# EAGLE design calc1 (EAGLE 5.11)
TITLE: Calcumaker

## Sheet 1 of 4
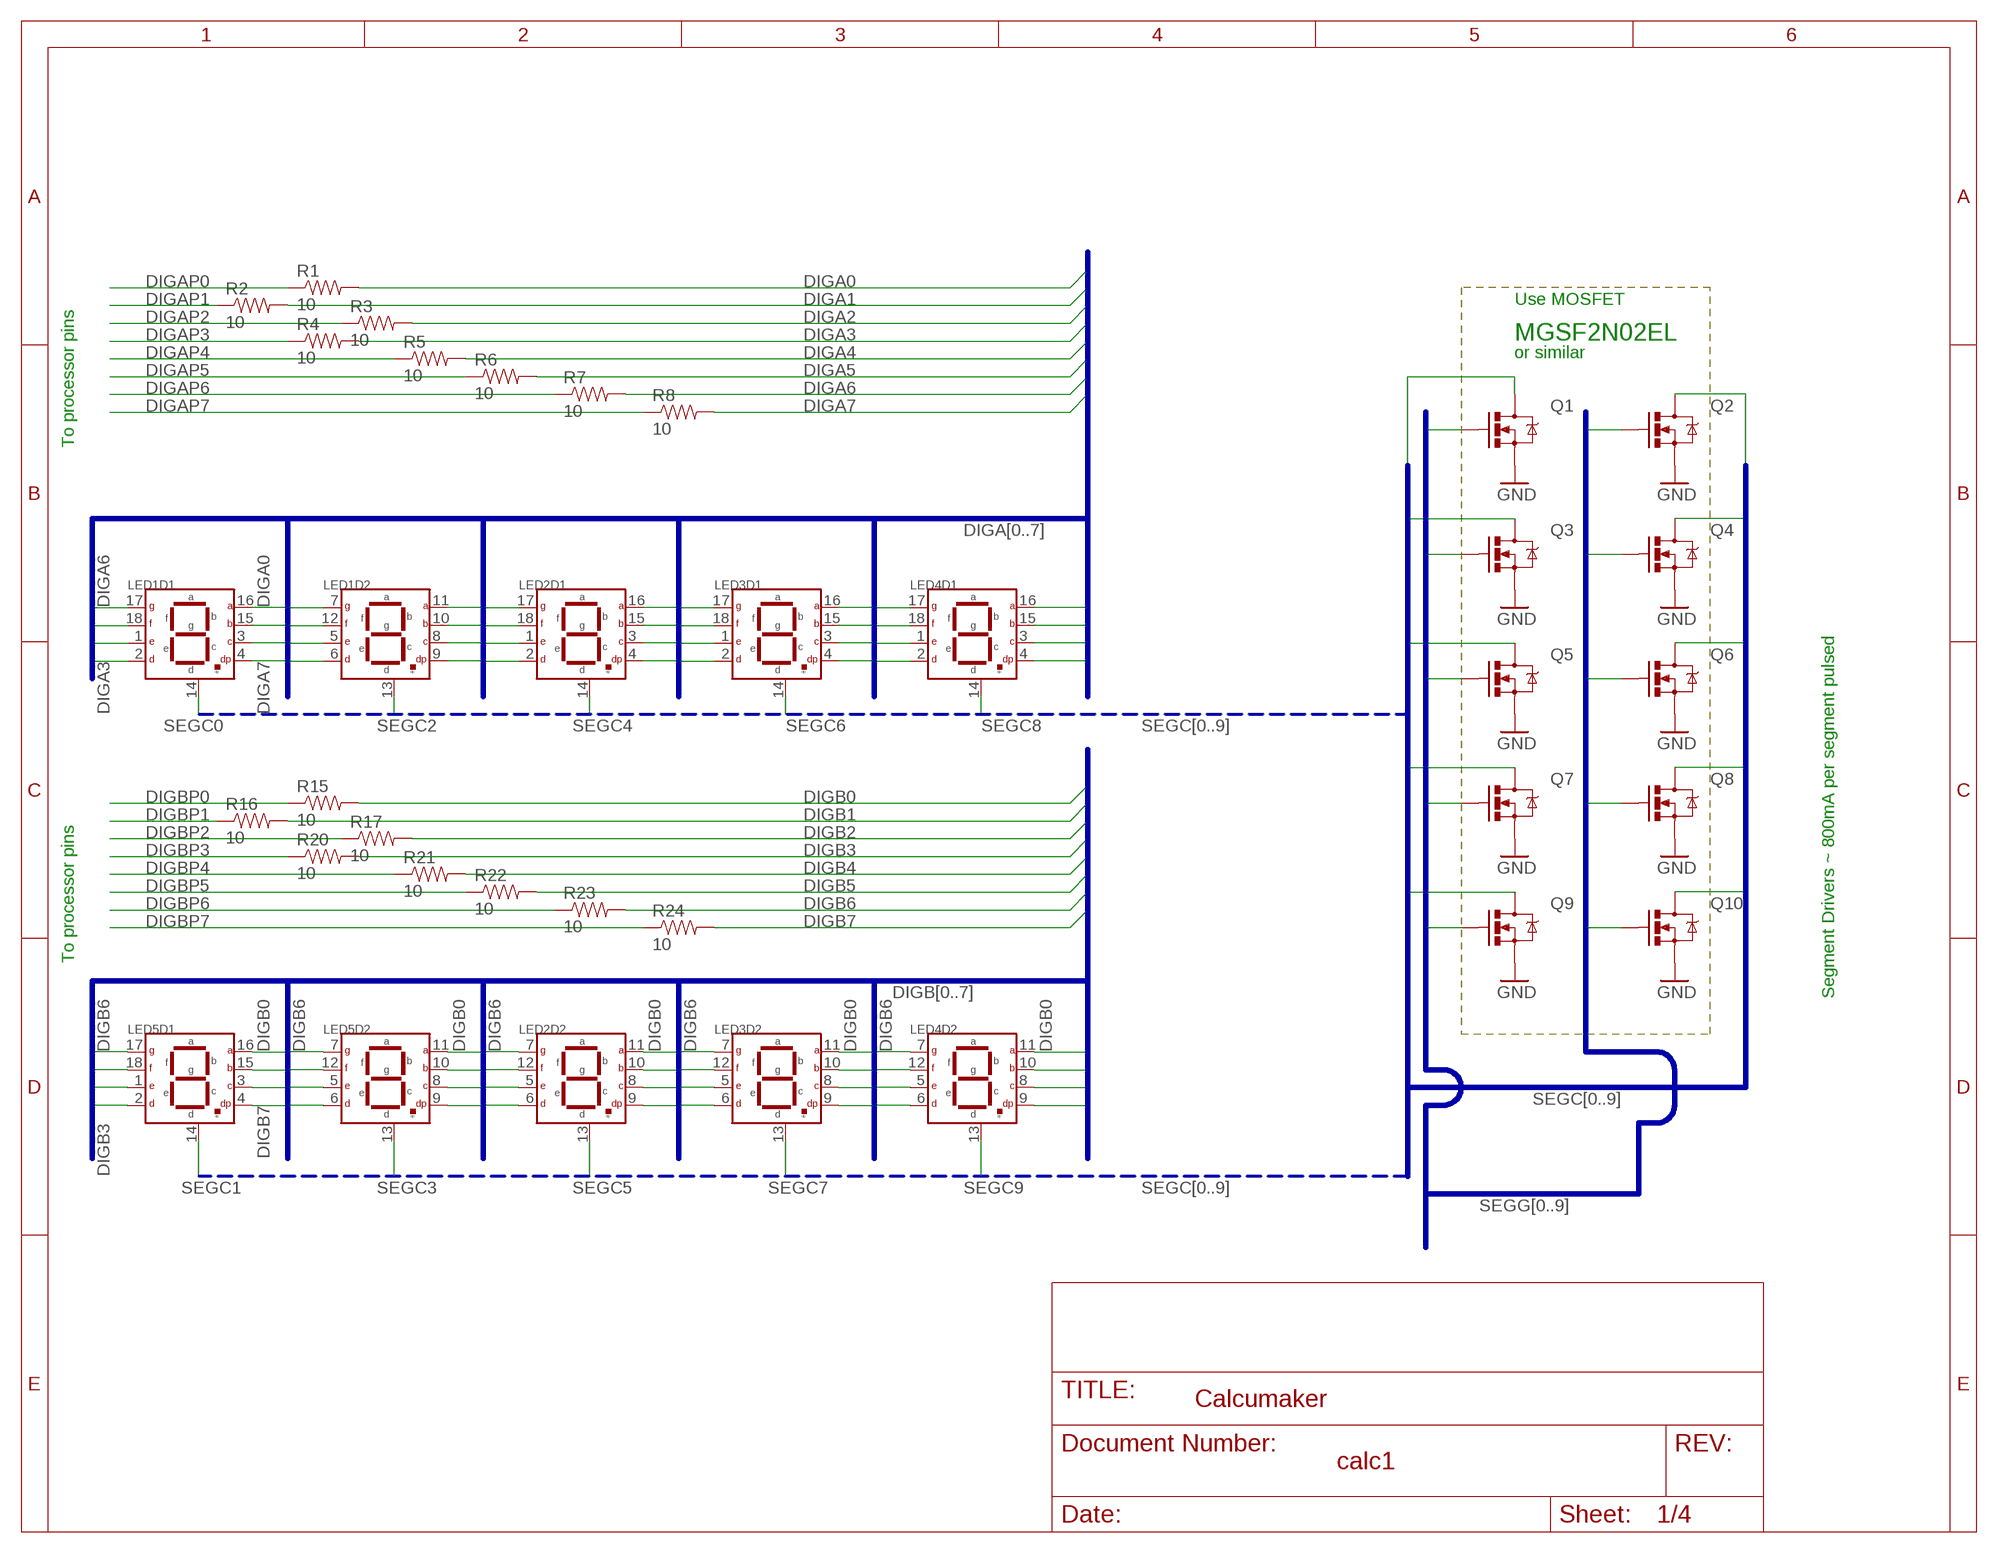
[diagram p0: schematic, sheet 1]

### Parts
LED1  2X7SEGMENT2X  [2X7SEG_PTH]
LED2  2X7SEGMENT2X  [2X7SEG_PTH]
LED3  2X7SEGMENT2X  [2X7SEG_PTH]
LED4  2X7SEGMENT2X  [2X7SEG_PTH]
LED5  2X7SEGMENT2X  [2X7SEG_PTH]
Q1  MOSFET-NCHANNELSMD  [SOT23-3]
Q2  MOSFET-NCHANNELSMD  [SOT23-3]
Q3  MOSFET-NCHANNELSMD  [SOT23-3]
Q4  MOSFET-NCHANNELSMD  [SOT23-3]
Q5  MOSFET-NCHANNELSMD  [SOT23-3]
Q6  MOSFET-NCHANNELSMD  [SOT23-3]
Q7  MOSFET-NCHANNELSMD  [SOT23-3]
Q8  MOSFET-NCHANNELSMD  [SOT23-3]
Q9  MOSFET-NCHANNELSMD  [SOT23-3]
Q10  MOSFET-NCHANNELSMD  [SOT23-3]
R1  10  RESISTOR  [0805]
R2  10  RESISTOR  [0805]
R3  10  RESISTOR  [0805]
R4  10  RESISTOR  [0805]
R5  10  RESISTOR  [0805]
R6  10  RESISTOR  [0805]
R7  10  RESISTOR  [0805]
R8  10  RESISTOR  [0805]
R15  10  RESISTOR  [0805]
R16  10  RESISTOR  [0805]
R17  10  RESISTOR  [0805]
R20  10  RESISTOR  [0805]
R21  10  RESISTOR  [0805]
R22  10  RESISTOR  [0805]
R23  10  RESISTOR  [0805]
R24  10  RESISTOR  [0805]

### Nets
DIGA0: LED1.11(D2:A) LED1.16(D1:A) LED2.16(D1:A) LED3.16(D1:A) LED4.16(D1:A) R1.2
DIGA1: LED1.10(D2:B) LED1.15(D1:B) LED2.15(D1:B) LED3.15(D1:B) LED4.15(D1:B) R2.2
DIGA2: LED1.3(D1:C) LED1.8(D2:C) LED2.3(D1:C) LED3.3(D1:C) LED4.3(D1:C) R3.2
DIGA3: LED1.2(D1:D) LED1.6(D2:D) LED2.2(D1:D) LED3.2(D1:D) LED4.2(D1:D) R4.2
DIGA4: LED1.1(D1:E) LED1.5(D2:E) LED2.1(D1:E) LED3.1(D1:E) LED4.1(D1:E) R5.2
DIGA5: LED1.12(D2:F) LED1.18(D1:F) LED2.18(D1:F) LED3.18(D1:F) LED4.18(D1:F) R6.2
DIGA6: LED1.7(D2:G) LED1.17(D1:G) LED2.17(D1:G) LED3.17(D1:G) LED4.17(D1:G) R7.2
DIGA7: LED1.4(D1:DP) LED1.9(D2:DP) LED2.4(D1:DP) LED3.4(D1:DP) LED4.4(D1:DP) R8.2
DIGAP0: R1.1 ; also sheet 2
DIGAP1: R2.1 ; also sheet 2
DIGAP2: R3.1 ; also sheet 2
DIGAP3: R4.1 ; also sheet 2
DIGAP4: R5.1 ; also sheet 2
DIGAP5: R6.1 ; also sheet 2
DIGAP6: R7.1 ; also sheet 2
DIGAP7: R8.1 ; also sheet 2
DIGB0: LED2.11(D2:A) LED3.11(D2:A) LED4.11(D2:A) LED5.11(D2:A) LED5.16(D1:A) R15.2
DIGB1: LED2.10(D2:B) LED3.10(D2:B) LED4.10(D2:B) LED5.10(D2:B) LED5.15(D1:B) R16.2
DIGB2: LED2.8(D2:C) LED3.8(D2:C) LED4.8(D2:C) LED5.3(D1:C) LED5.8(D2:C) R17.2
DIGB3: LED2.6(D2:D) LED3.6(D2:D) LED4.6(D2:D) LED5.2(D1:D) LED5.6(D2:D) R20.2
DIGB4: LED2.5(D2:E) LED3.5(D2:E) LED4.5(D2:E) LED5.1(D1:E) LED5.5(D2:E) R21.2
DIGB5: LED2.12(D2:F) LED3.12(D2:F) LED4.12(D2:F) LED5.12(D2:F) LED5.18(D1:F) R22.2
DIGB6: LED2.7(D2:G) LED3.7(D2:G) LED4.7(D2:G) LED5.7(D2:G) LED5.17(D1:G) R23.2
DIGB7: LED2.9(D2:DP) LED3.9(D2:DP) LED4.9(D2:DP) LED5.4(D1:DP) LED5.9(D2:DP) R24.2
DIGBP0: R15.1 ; also sheet 2
DIGBP1: R16.1 ; also sheet 2
DIGBP2: R17.1 ; also sheet 2
DIGBP3: R20.1 ; also sheet 2
DIGBP4: R21.1 ; also sheet 2
DIGBP5: R22.1 ; also sheet 2
DIGBP6: R23.1 ; also sheet 2
DIGBP7: R24.1 ; also sheet 2
GND: Q1.2(S) Q2.2(S) Q3.2(S) Q4.2(S) Q5.2(S) Q6.2(S) Q7.2(S) Q8.2(S) Q9.2(S) Q10.2(S) ; also sheet 2,3
SEGC0: LED1.14(D1:CC) Q1.3(D)
SEGC1: LED5.14(D1:CC) Q3.3(D)
SEGC2: LED1.13(D2:CC) Q5.3(D)
SEGC3: LED5.13(D2:CC) Q7.3(D)
SEGC4: LED2.14(D1:CC) Q9.3(D)
SEGC5: LED2.13(D2:CC) Q2.3(D)
SEGC6: LED3.14(D1:CC) Q4.3(D)
SEGC7: LED3.13(D2:CC) Q6.3(D)
SEGC8: LED4.14(D1:CC) Q8.3(D)
SEGC9: LED4.13(D2:CC) Q10.3(D)
SEGG0: Q1.1(G) ; also sheet 2
SEGG1: Q3.1(G) ; also sheet 2
SEGG2: Q5.1(G) ; also sheet 2
SEGG3: Q7.1(G) ; also sheet 2
SEGG4: Q9.1(G) ; also sheet 2
SEGG5: Q2.1(G) ; also sheet 2
SEGG6: Q4.1(G) ; also sheet 2
SEGG7: Q6.1(G) ; also sheet 2
SEGG8: Q8.1(G) ; also sheet 2
SEGG9: Q10.1(G) ; also sheet 2

### Buses
DIGA[0..7]
SEGC[0..9]
SEGG[0..9]
DIGB[0..7]

### Notes on the sheet
- Use MOSFET
- MGSF2N02EL
- or similar
- To processor pins
- To processor pins
- Segment Drivers ~ 800mA per segment pulsed

## Sheet 2 of 4
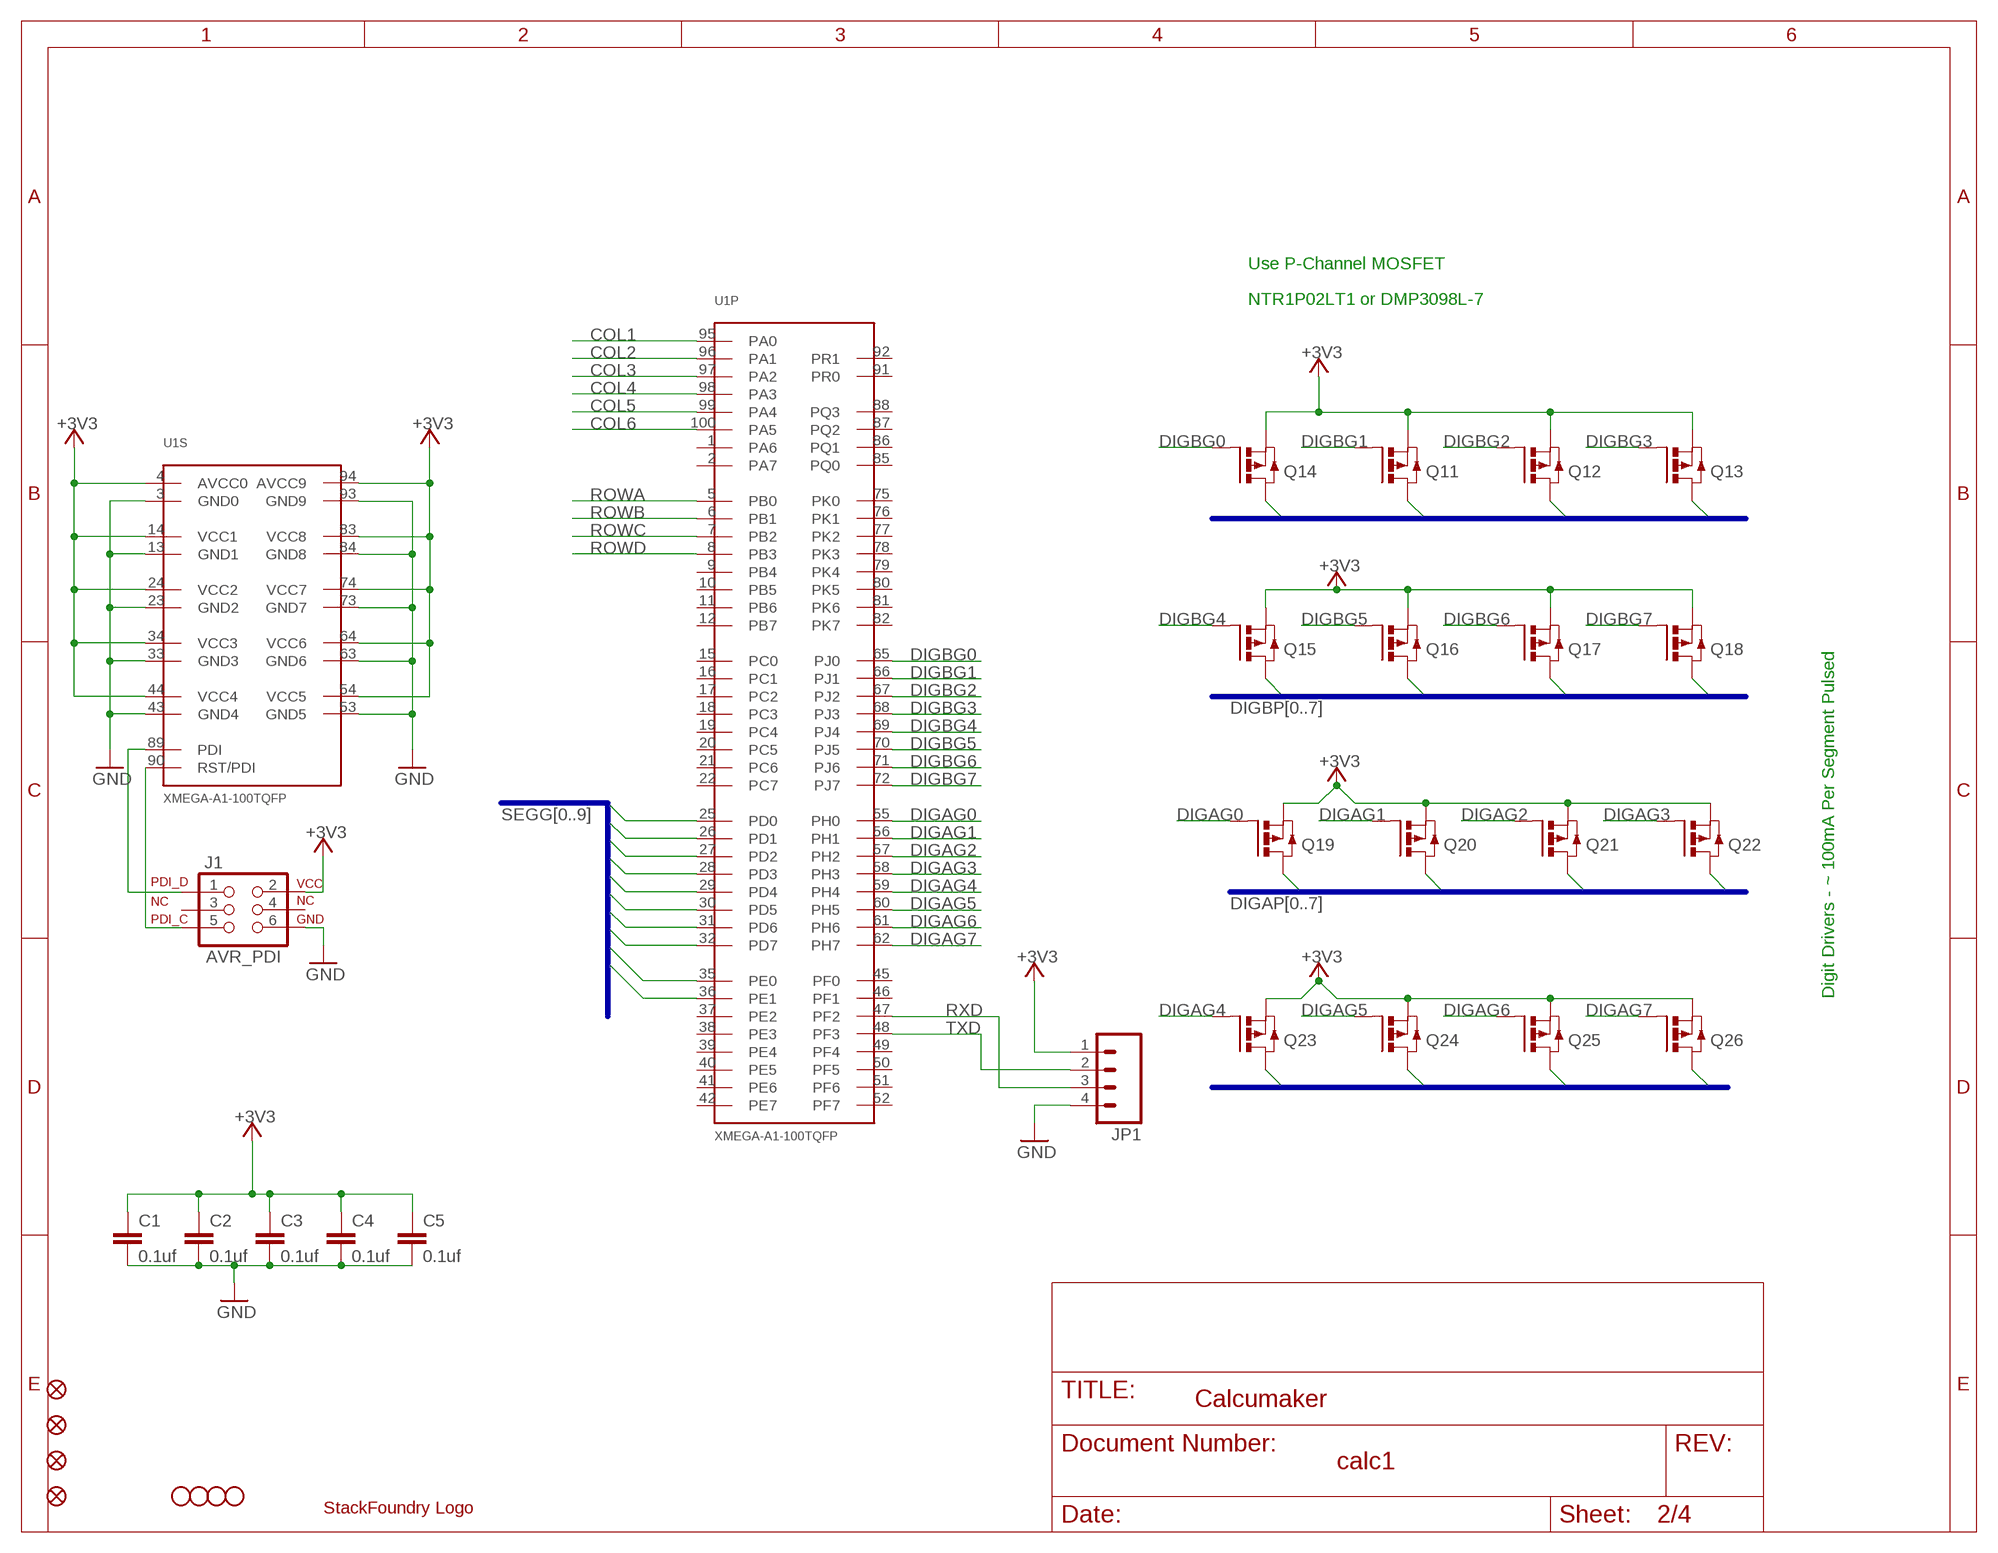
[diagram p1: schematic, sheet 2]

### Parts
$2_80_$  FIDUCIAL1.5X3  [FIDUCIAL-1.5X3]
$2_85_$  STAND-OFF  [STAND-OFF]
C1  0.1uf  CAP0603  [0603]
C2  0.1uf  CAP0603  [0603]
C3  0.1uf  CAP0603  [0603]
C4  0.1uf  CAP0603  [0603]
C5  0.1uf  CAP0603  [0603]
J1  AVR_PDI  [2X3]
JP1  M04PTH  [1X04]
LOGO1  SFLOGO  [SFLOGO]
Q11  NTR1P02LT1  [SOT23]
Q12  NTR1P02LT1  [SOT23]
Q13  NTR1P02LT1  [SOT23]
Q14  NTR1P02LT1  [SOT23]
Q15  NTR1P02LT1  [SOT23]
Q16  NTR1P02LT1  [SOT23]
Q17  NTR1P02LT1  [SOT23]
Q18  NTR1P02LT1  [SOT23]
Q19  NTR1P02LT1  [SOT23]
Q20  NTR1P02LT1  [SOT23]
Q21  NTR1P02LT1  [SOT23]
Q22  NTR1P02LT1  [SOT23]
Q23  NTR1P02LT1  [SOT23]
Q24  NTR1P02LT1  [SOT23]
Q25  NTR1P02LT1  [SOT23]
Q26  NTR1P02LT1  [SOT23]
U1  XMEGA-A1-100TQFP  [TQFP100]
U$2  FIDUCIAL1.5X3  [FIDUCIAL-1.5X3]
U$3  FIDUCIAL1.5X3  [FIDUCIAL-1.5X3]
U$4  FIDUCIAL1.5X3  [FIDUCIAL-1.5X3]
U$5  STAND-OFF  [STAND-OFF]
U$7  STAND-OFF  [STAND-OFF]
U$8  STAND-OFF  [STAND-OFF]

### Nets
+3V3: C1.1 C2.1 C3.1 C4.1 C5.1 J1.2 JP1.1 Q11.2(S) Q12.2(S) Q13.2(S) Q14.2(S) Q15.2(S) Q16.2(S) Q17.2(S) Q18.2(S) Q19.2(S) Q20.2(S) Q21.2(S) Q22.2(S) Q23.2(S) Q24.2(S) Q25.2(S) Q26.2(S) U1.4(S:AVCC0) U1.14(S:VCC1) U1.24(S:VCC2) U1.34(S:VCC3) U1.44(S:VCC4) U1.54(S:VCC5) U1.64(S:VCC6) U1.74(S:VCC7) U1.83(S:VCC8) U1.94(S:AVCC9) ; also sheet 3
COL1: U1.95(P:PA0) ; also sheet 4
COL2: U1.96(P:PA1) ; also sheet 4
COL3: U1.97(P:PA2) ; also sheet 4
COL4: U1.98(P:PA3) ; also sheet 4
COL5: U1.99(P:PA4) ; also sheet 4
COL6: U1.100(P:PA5) ; also sheet 4
DIGAG0: Q19.1(G) U1.55(P:PH0)
DIGAG1: Q20.1(G) U1.56(P:PH1)
DIGAG2: Q21.1(G) U1.57(P:PH2)
DIGAG3: Q22.1(G) U1.58(P:PH3)
DIGAG4: Q23.1(G) U1.59(P:PH4)
DIGAG5: Q24.1(G) U1.60(P:PH5)
DIGAG6: Q25.1(G) U1.61(P:PH6)
DIGAG7: Q26.1(G) U1.62(P:PH7)
DIGAP0: Q19.3(D) ; also sheet 1
DIGAP1: Q20.3(D) ; also sheet 1
DIGAP2: Q21.3(D) ; also sheet 1
DIGAP3: Q22.3(D) ; also sheet 1
DIGAP4: Q23.3(D) ; also sheet 1
DIGAP5: Q24.3(D) ; also sheet 1
DIGAP6: Q25.3(D) ; also sheet 1
DIGAP7: Q26.3(D) ; also sheet 1
DIGBG0: Q14.1(G) U1.65(P:PJ0)
DIGBG1: Q11.1(G) U1.66(P:PJ1)
DIGBG2: Q12.1(G) U1.67(P:PJ2)
DIGBG3: Q13.1(G) U1.68(P:PJ3)
DIGBG4: Q15.1(G) U1.69(P:PJ4)
DIGBG5: Q16.1(G) U1.70(P:PJ5)
DIGBG6: Q17.1(G) U1.71(P:PJ6)
DIGBG7: Q18.1(G) U1.72(P:PJ7)
DIGBP0: Q14.3(D) ; also sheet 1
DIGBP1: Q11.3(D) ; also sheet 1
DIGBP2: Q12.3(D) ; also sheet 1
DIGBP3: Q13.3(D) ; also sheet 1
DIGBP4: Q15.3(D) ; also sheet 1
DIGBP5: Q16.3(D) ; also sheet 1
DIGBP6: Q17.3(D) ; also sheet 1
DIGBP7: Q18.3(D) ; also sheet 1
GND: C1.2 C2.2 C3.2 C4.2 C5.2 J1.6 JP1.4 U1.3(S:GND0) U1.13(S:GND1) U1.23(S:GND2) U1.33(S:GND3) U1.43(S:GND4) U1.53(S:GND5) U1.63(S:GND6) U1.73(S:GND7) U1.84(S:GND8) U1.93(S:GND9) ; also sheet 1,3
N$1: J1.1 U1.89(S:PDI)
N$2: J1.5 U1.90(S:RST/PDI)
ROWA: U1.5(P:PB0) ; also sheet 4
ROWB: U1.6(P:PB1) ; also sheet 4
ROWC: U1.7(P:PB2) ; also sheet 4
ROWD: U1.8(P:PB3) ; also sheet 4
RXD: JP1.3 U1.47(P:PF2)
SEGG0: U1.25(P:PD0) ; also sheet 1
SEGG1: U1.26(P:PD1) ; also sheet 1
SEGG2: U1.27(P:PD2) ; also sheet 1
SEGG3: U1.28(P:PD3) ; also sheet 1
SEGG4: U1.29(P:PD4) ; also sheet 1
SEGG5: U1.30(P:PD5) ; also sheet 1
SEGG6: U1.31(P:PD6) ; also sheet 1
SEGG7: U1.32(P:PD7) ; also sheet 1
SEGG8: U1.35(P:PE0) ; also sheet 1
SEGG9: U1.36(P:PE1) ; also sheet 1
TXD: JP1.2 U1.48(P:PF3)
Unconnected: J1.3 J1.4 U1.1(P:PA6) U1.2(P:PA7) U1.9(P:PB4) U1.10(P:PB5) U1.11(P:PB6) U1.12(P:PB7) U1.15(P:PC0) U1.16(P:PC1) U1.17(P:PC2) U1.18(P:PC3) U1.19(P:PC4) U1.20(P:PC5) U1.21(P:PC6) U1.22(P:PC7) U1.37(P:PE2) U1.38(P:PE3) U1.39(P:PE4) U1.40(P:PE5) U1.41(P:PE6) U1.42(P:PE7) U1.45(P:PF0) U1.46(P:PF1) U1.49(P:PF4) U1.50(P:PF5) U1.51(P:PF6) U1.52(P:PF7) U1.75(P:PK0) U1.76(P:PK1) U1.77(P:PK2) U1.78(P:PK3) U1.79(P:PK4) U1.80(P:PK5) U1.81(P:PK6) U1.82(P:PK7) U1.85(P:PQ0) U1.86(P:PQ1) U1.87(P:PQ2) U1.88(P:PQ3) U1.91(P:PR0) U1.92(P:PR1)

### Buses
DIGAP[0..7]
SEGG[0..9]
DIGBP[0..7]

### Notes on the sheet
- Use P-Channel MOSFET
- NTR1P02LT1 or DMP3098L-7
- Digit Drivers - ~ 100mA Per Segment Pulsed

## Sheet 3 of 4
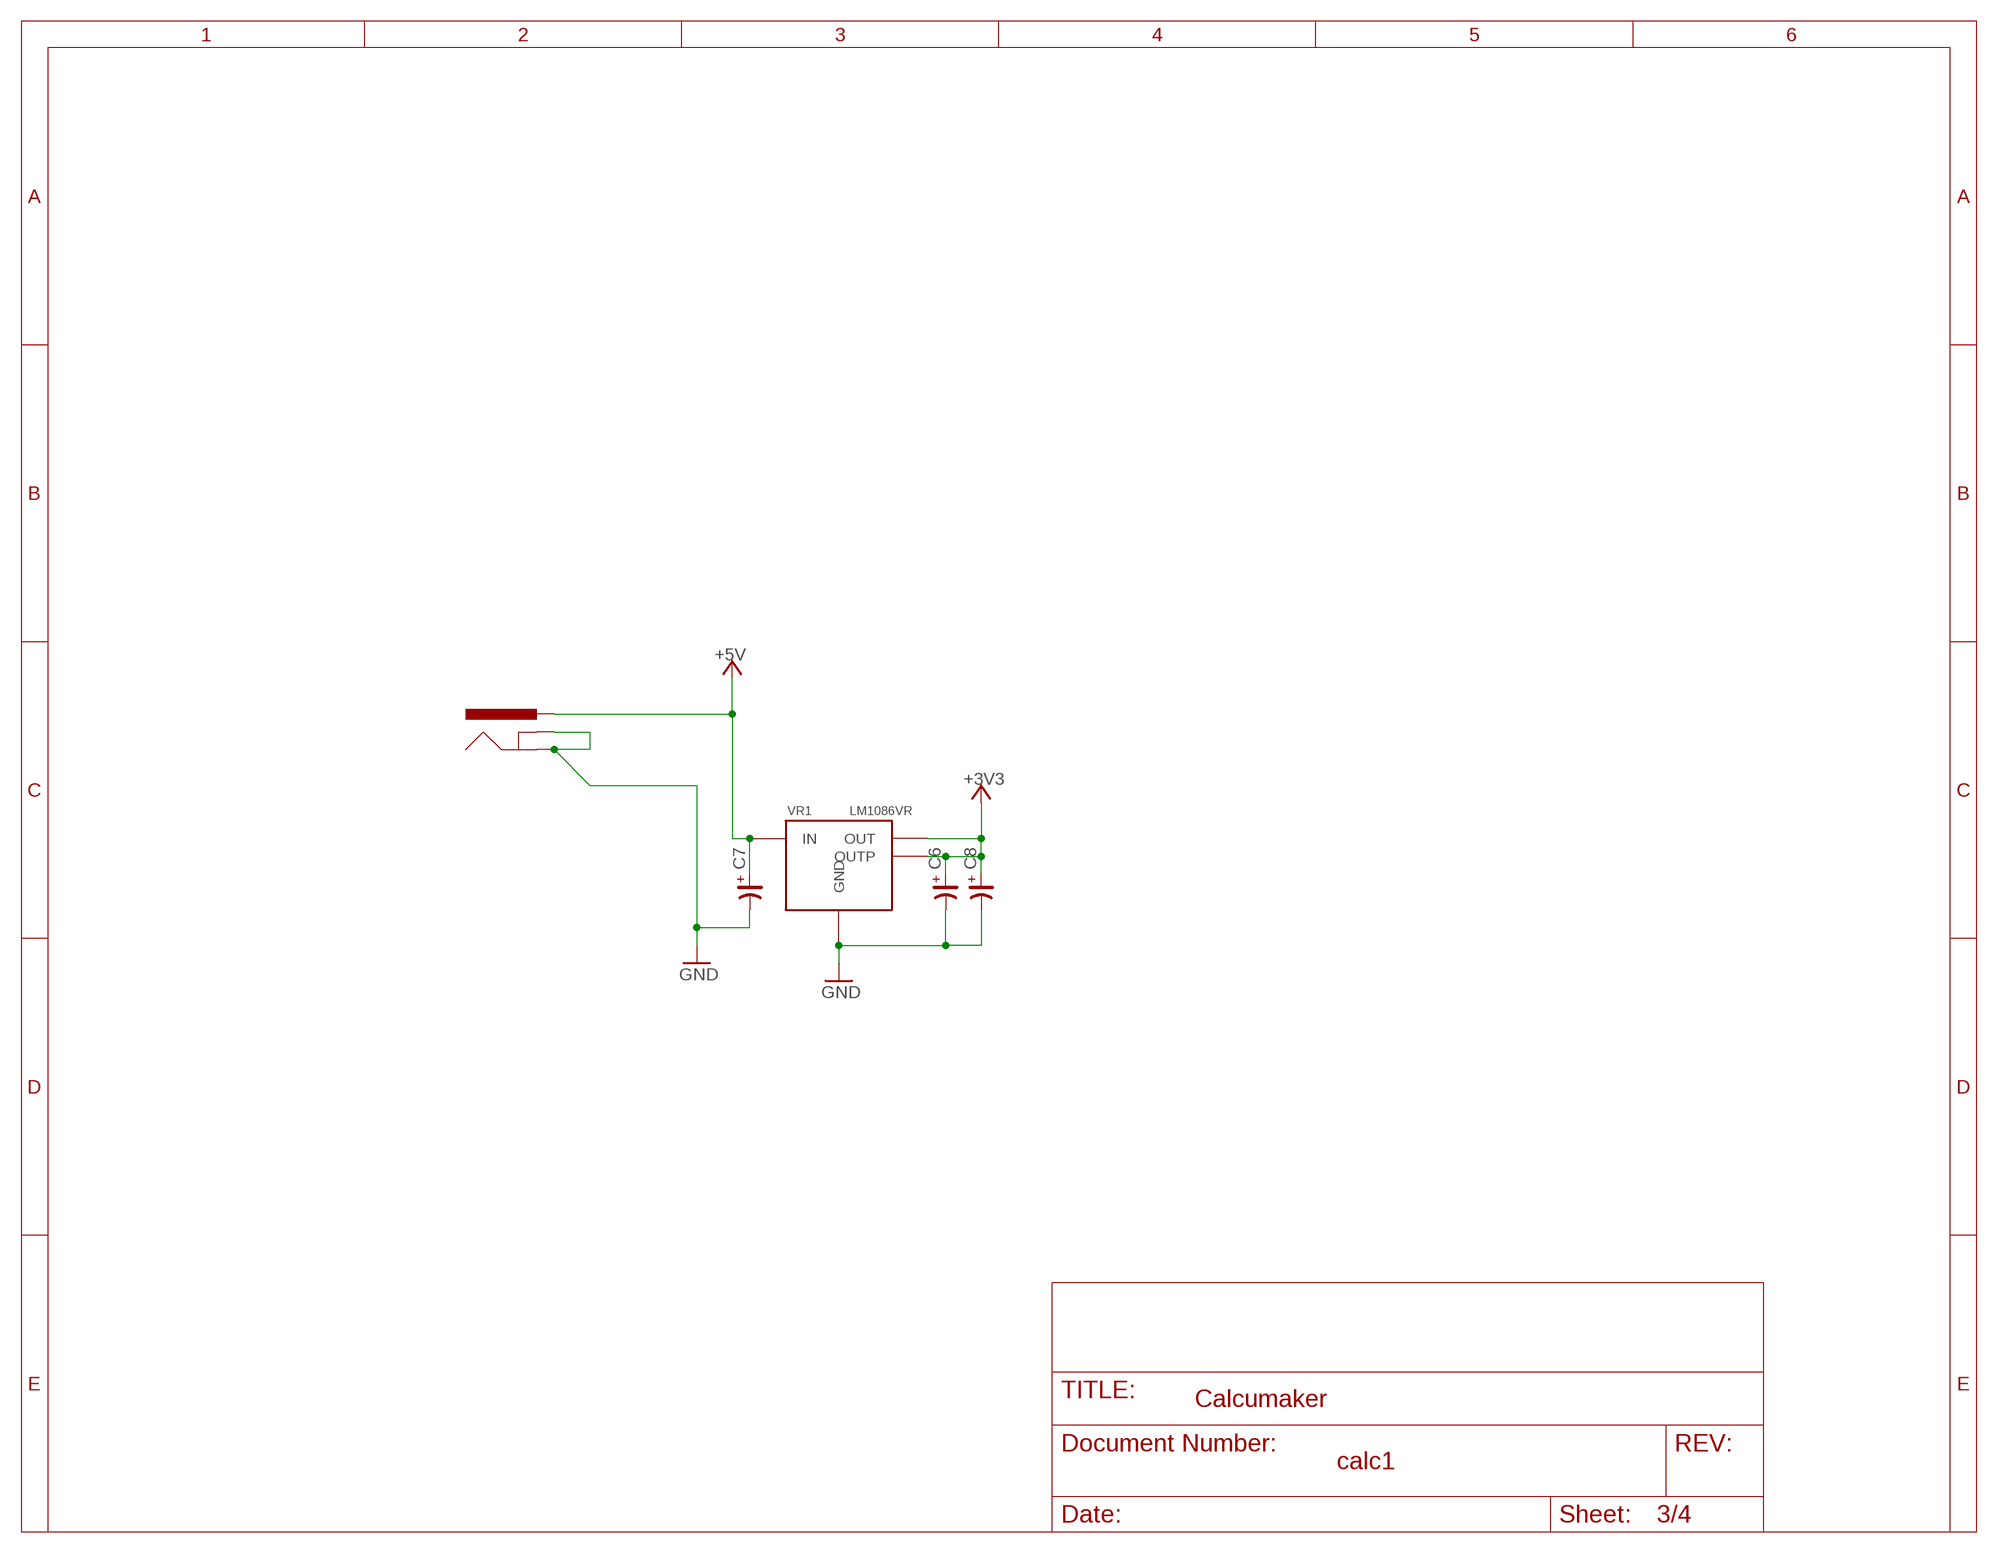
[diagram p2: schematic, sheet 3]

### Parts
C6  CP_SV-D  [CSV-D]
C7  CP_SV-D  [CSV-D]
C8  CP_SV-D  [CSV-D]
J2  POWER_JACKSLT  [POWER_JACK_SLOT]
VR1  LM1086VR  [TO263]

### Nets
+3V3: C6.+ C8.+ VR1.2(OUT) VR1.TAB(OUTP) ; also sheet 2
+5V: C7.+ J2.PWR VR1.3(IN)
GND: C6.- C7.- C8.- J2.GND@1(GNDBREAK) J2.GND@2(GND) VR1.1(GND) ; also sheet 1,2

## Sheet 4 of 4
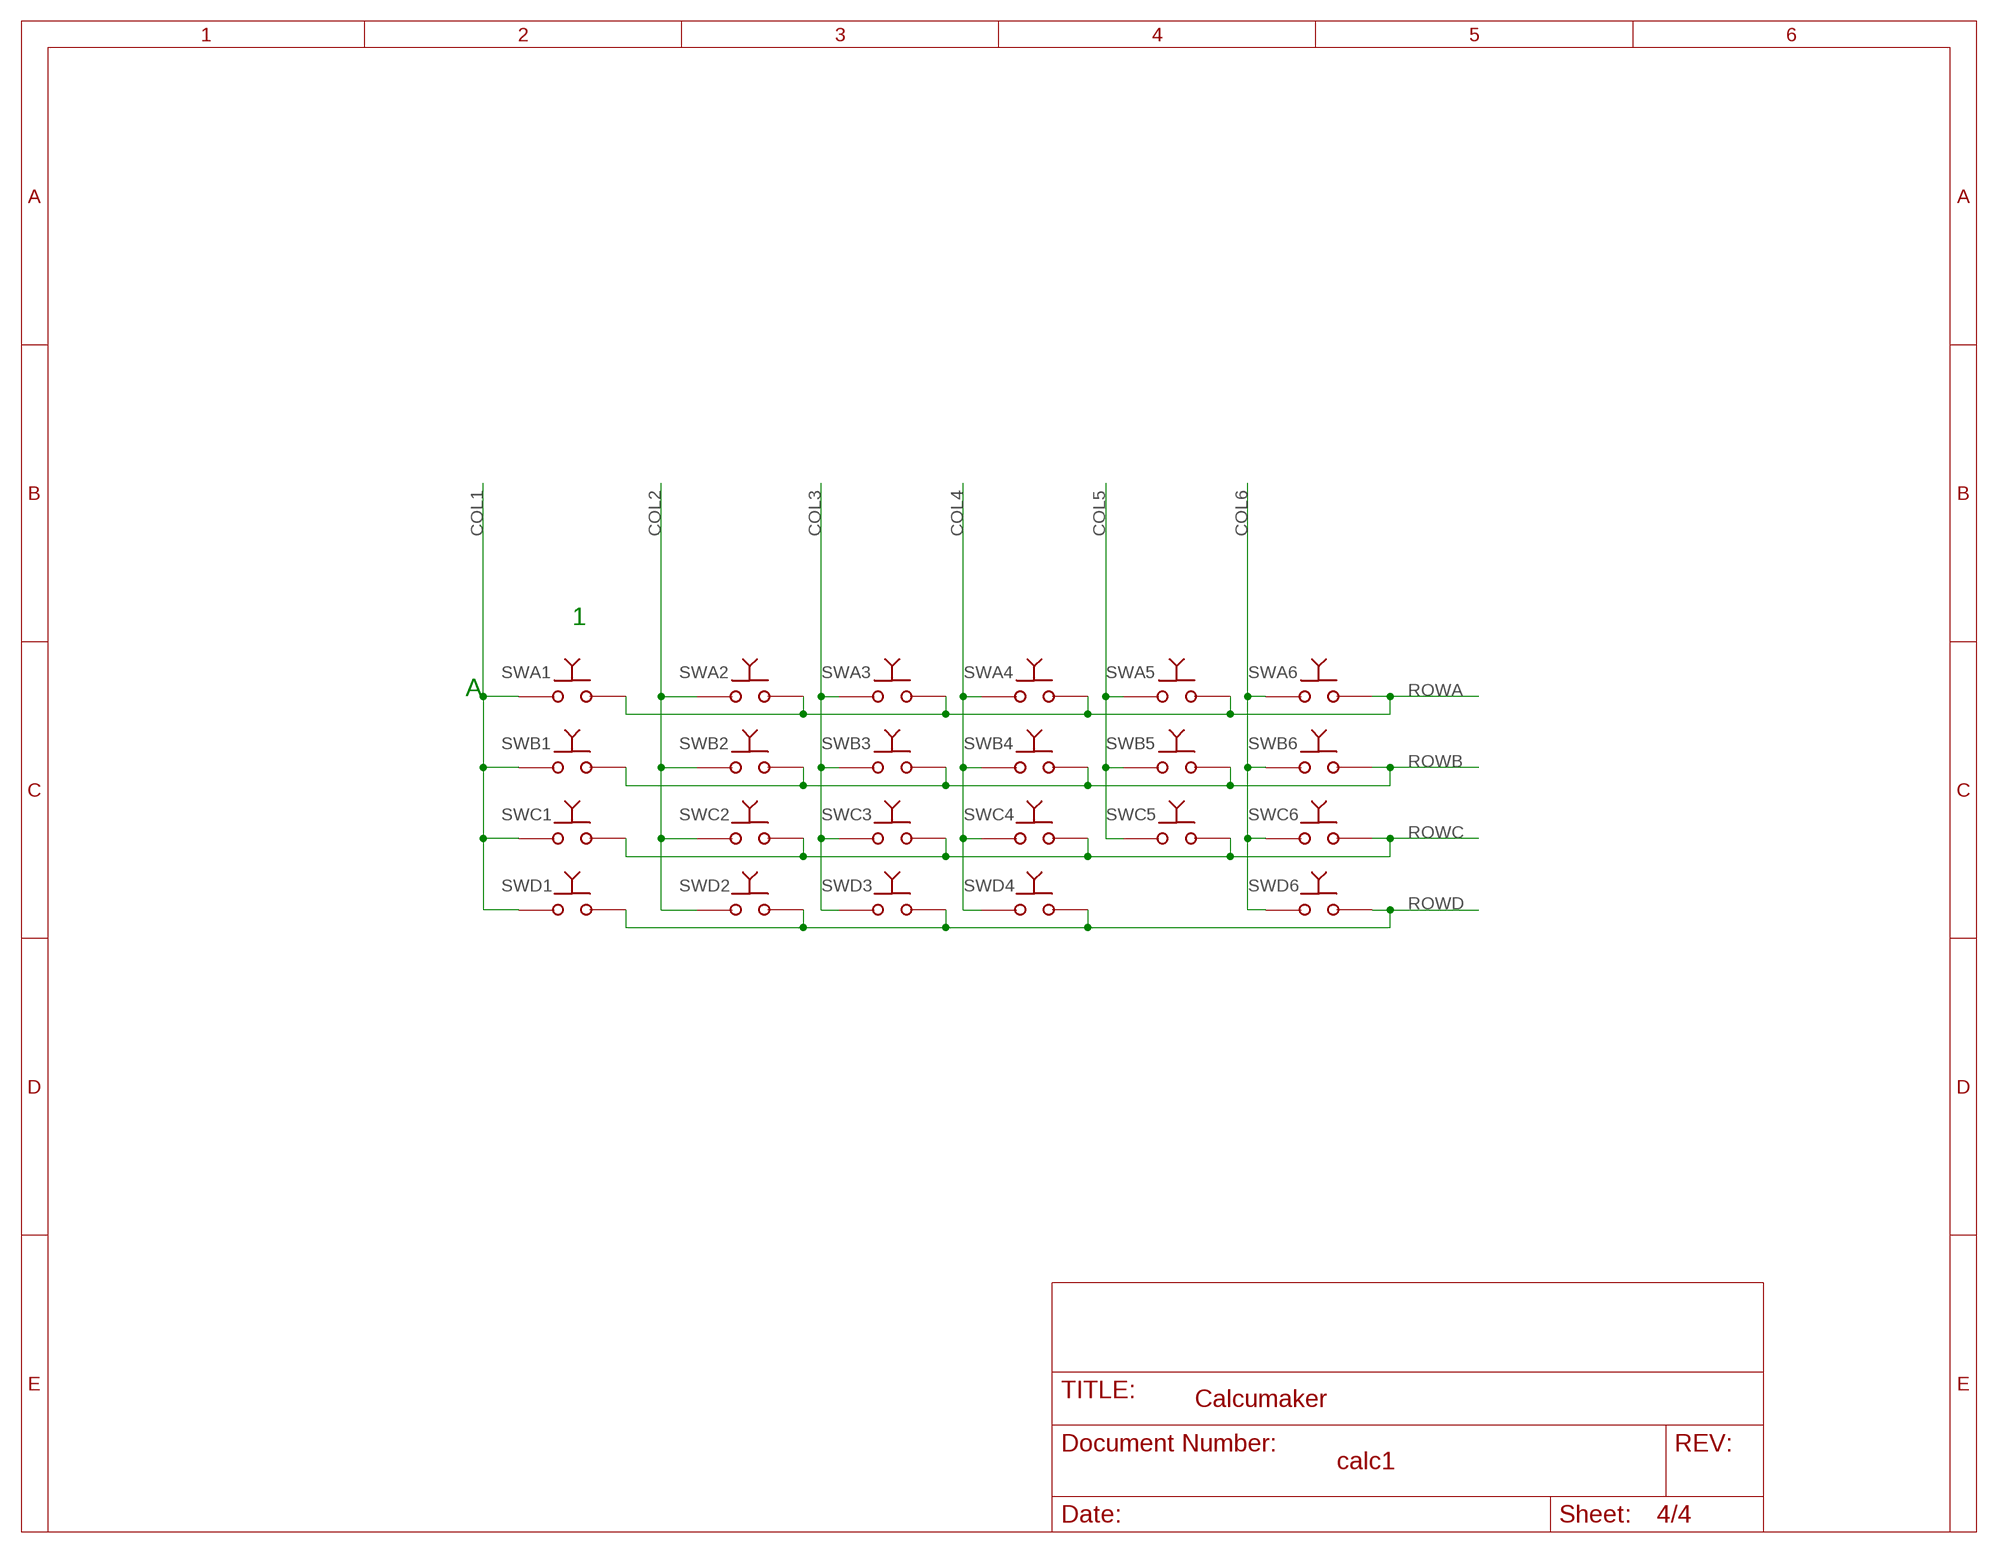
[diagram p3: schematic, sheet 4]

### Parts
SWA1  320E1-1  [320E1-1]
SWA2  320E1-1  [320E1-1]
SWA3  320E1-1  [320E1-1]
SWA4  320E1-1  [320E1-1]
SWA5  320E1-1  [320E1-1]
SWA6  320E1-1  [320E1-1]
SWB1  320E1-1  [320E1-1]
SWB2  320E1-1  [320E1-1]
SWB3  320E1-1  [320E1-1]
SWB4  320E1-1  [320E1-1]
SWB5  320E1-1  [320E1-1]
SWB6  320E1-1  [320E1-1]
SWC1  320E1-1  [320E1-1]
SWC2  320E1-1  [320E1-1]
SWC3  320E1-1  [320E1-1]
SWC4  320E1-1  [320E1-1]
SWC5  320E1-1  [320E1-1]
SWC6  320E1-1  [320E1-1]
SWD1  320E1-1  [320E1-1]
SWD2  320E1-1  [320E1-1]
SWD3  320E1-1  [320E1-1]
SWD4  320E1-1  [320E1-1]
SWD6  320E1-1  [320E1-1]

### Nets
COL1: SWA1.P$1 SWB1.P$1 SWC1.P$1 SWD1.P$1 ; also sheet 2
COL2: SWA2.P$1 SWB2.P$1 SWC2.P$1 SWD2.P$1 ; also sheet 2
COL3: SWA3.P$1 SWB3.P$1 SWC3.P$1 SWD3.P$1 ; also sheet 2
COL4: SWA4.P$1 SWB4.P$1 SWC4.P$1 SWD4.P$1 ; also sheet 2
COL5: SWA5.P$1 SWB5.P$1 SWC5.P$1 ; also sheet 2
COL6: SWA6.P$1 SWB6.P$1 SWC6.P$1 SWD6.P$1 ; also sheet 2
ROWA: SWA1.P$2 SWA2.P$2 SWA3.P$2 SWA4.P$2 SWA5.P$2 SWA6.P$2 ; also sheet 2
ROWB: SWB1.P$2 SWB2.P$2 SWB3.P$2 SWB4.P$2 SWB5.P$2 SWB6.P$2 ; also sheet 2
ROWC: SWC1.P$2 SWC2.P$2 SWC3.P$2 SWC4.P$2 SWC5.P$2 SWC6.P$2 ; also sheet 2
ROWD: SWD1.P$2 SWD2.P$2 SWD3.P$2 SWD4.P$2 SWD6.P$2 ; also sheet 2

### Notes on the sheet
- 1
- A

## Library data of the parts
$2_80_$ U$2-U$4 = SparkFun:FIDUCIAL: Fiducial Alignment Points Various fiducial points for machine vision alignment.
$2_85_$ U$5 U$7 U$8 = SparkFun:STAND-OFF: Stand Off This is the mechanical footprint for a #4 phillips button head screw. Use the keepout ring to avoid running the screw head into surrounding components. SKU : PRT-00447
C1-C5 = SparkFun:CAP: Capacitor Standard 0603 ceramic capacitor, and 0.1" leaded capacitor.
C6-C8 = rc-master-smd:CP_: POLARIZED CAP
J1 = con-headers:AVR_PDI
J2 = SparkFun:POWER_JACK: Power Jack This is the standard 5.5mm barrel jack for power. The PTH is the most common, proven, reliable, footprint. All others are experimental. The Slot footprint only works if the mill layer is transmitted to the PCB fab house so be warned. Spark Fun Electronics SKU : PRT-00119. Mating wall wart : TOL-00298 (and others)
JP1 = con-headers:M04
LED1-LED5 = 7segment:2X7SEGMENT
LOGO1 = logos:SFLOGO
Q1-Q10 = SparkFun:MOSFET-NCHANNEL
Q11-Q26 = onsemi:NTR1P02LT1: Power MOSFET, -20V, -1.3A, P-Channel, SOT-23
R1-R8 R15-R17 R20-R24 = SparkFun:RESISTOR: Resistor Basic schematic elements and footprints for 0603, 1206, and PTH 1/10th watt (small) resistors.
SWA1-SWA6 SWB1-SWB6 SWC1-SWC6 SWD1-SWD4 SWD6 = switch:320E1-1
U1 = atmel:XMEGA-A1-100: Atmel XMEGA 100 pin devices, A1 series Supply pins are on a different symbol.
VR1 = LM1086:LM1086

## Board
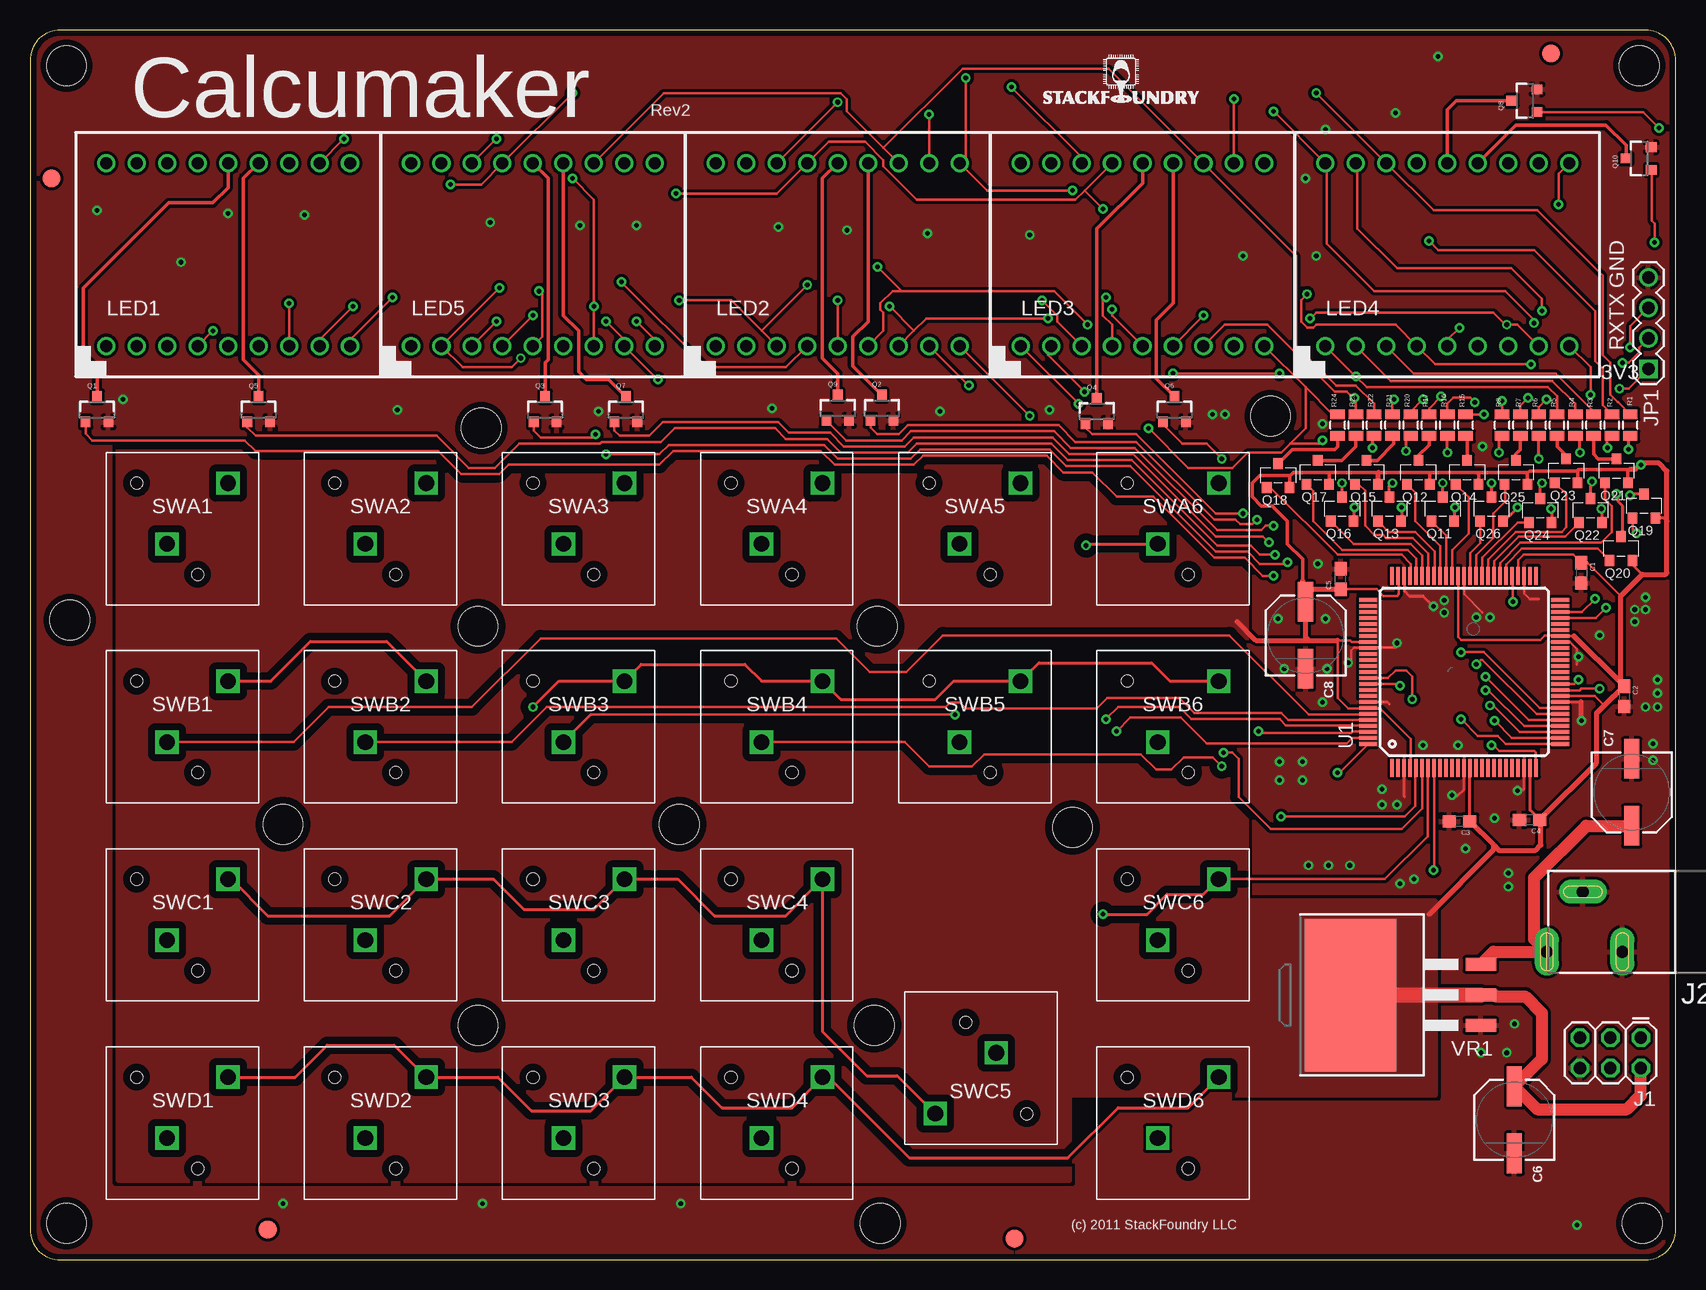
[diagram p4: board, top side]
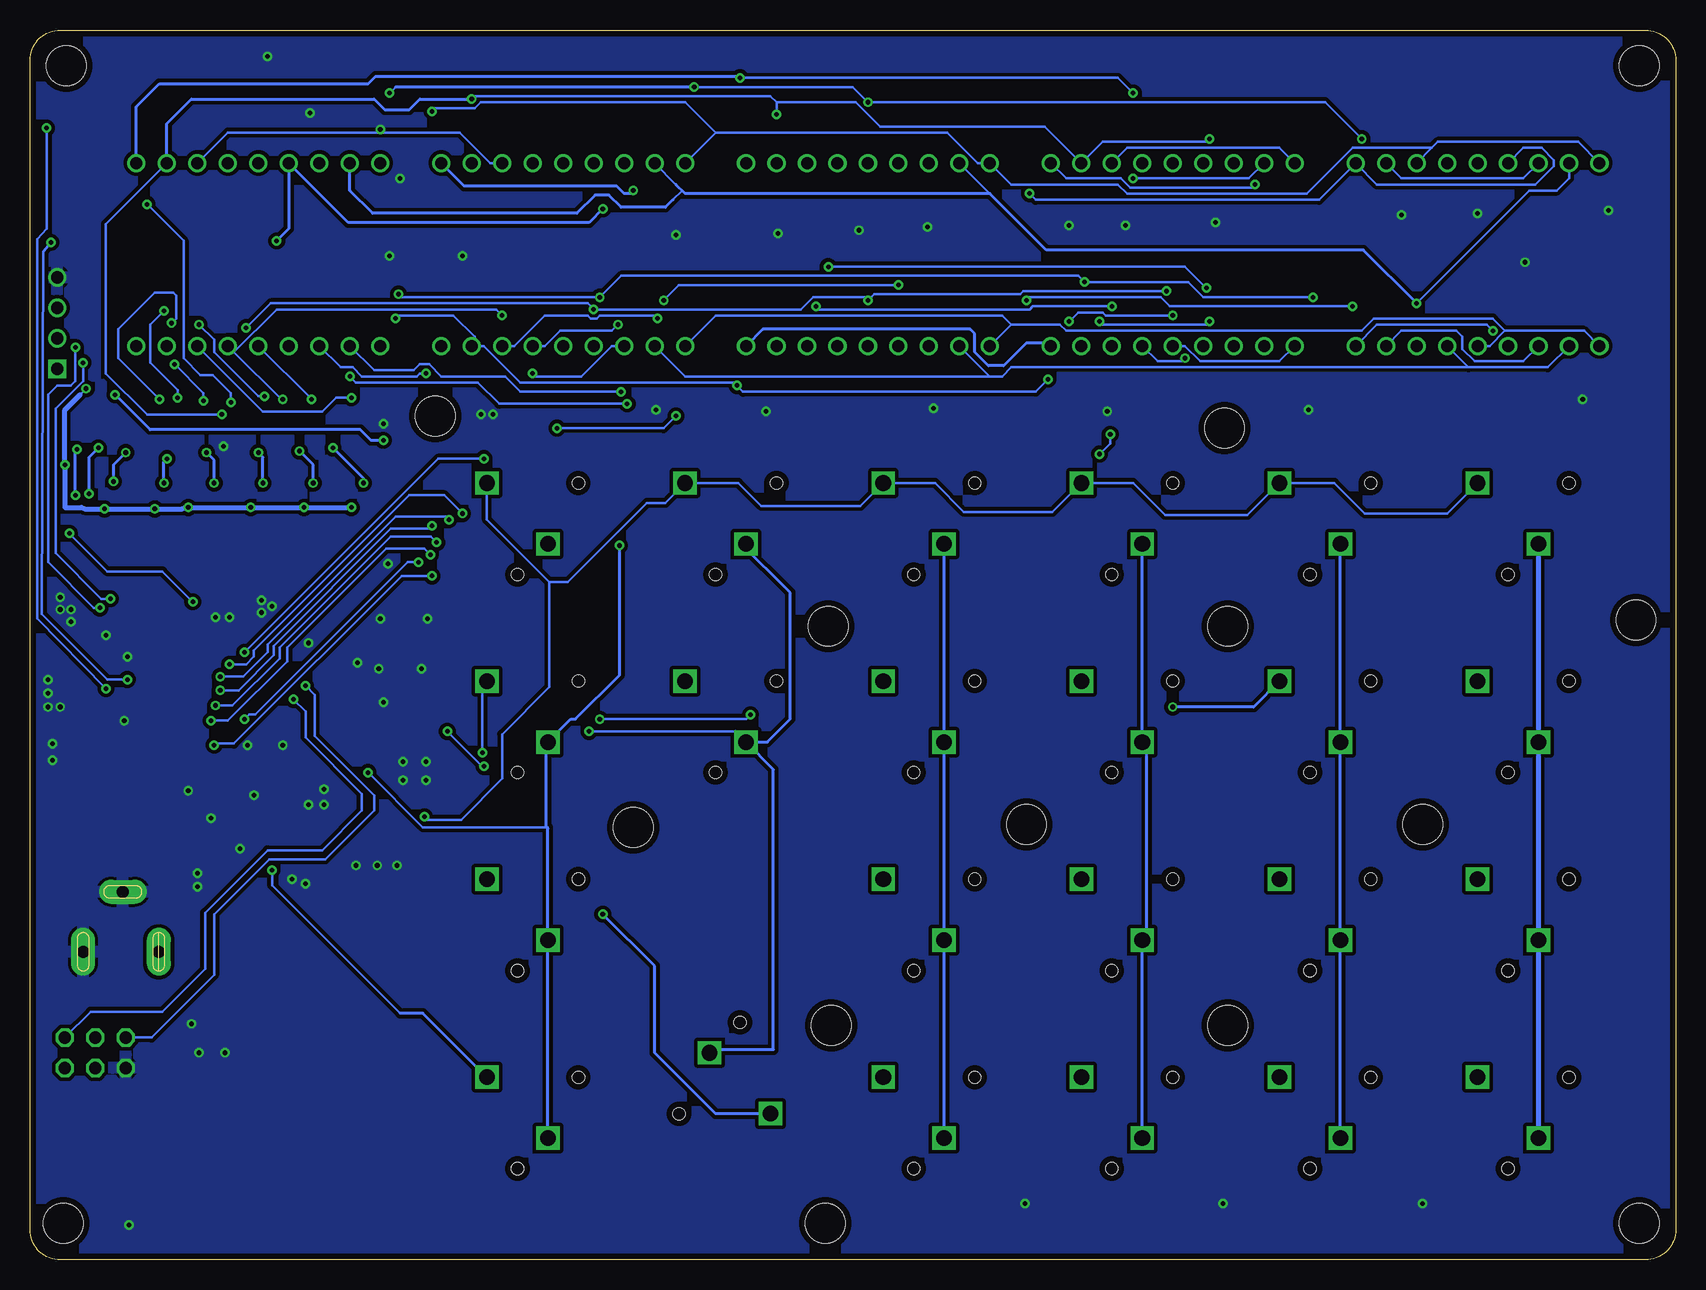
[diagram p5: board, bottom side, seen from below]

Size 137.14 x 102.54 mm. Coordinates in mm from the lower left corner, seen from the top.
Outline: 137.14,100 arc90 134.6,102.54 2.54,102.54 arc90 0,100 0,2.54 arc90 2.54,0 134.6,0 arc90 137.14,2.54 137.14,100
Copper layers (1*16): Top 0.035mm / dielectric 1.5mm / Bottom 0.035mm
Design rules "default *": minimum track width 8mil, minimum drill 15mil, track to track 7mil, track to pad 7mil, pad to pad 7mil, via to via 7mil, smd to smd 7mil, copper to edge 20mil, drill to drill 8mil, minimum pad ring 10mil, minimum via ring 8mil, stop-mask expansion 4mil, vias tented up to drill 15mil, thermal gap 10mil

### Footprints (pad centres in the part's own frame; a part is rotated, then mirrored left to right if it is on the bottom)
FIDUCIAL-1.5X3 = smd 1.5 x 1.5: 1 0,0
STAND-OFF = hole 3.302: 0,0
0603 = smd 1.1 x 1: 1 -0.85,0; 2 0.85,0
CSV-D = smd 3.302 x 1.27: + -2.794,0; - 2.794,0
2X3 = drill 1.016 octagon: 1 0,0; 2 0,2.54; 3 2.54,0; 4 2.54,2.54; 5 5.08,0; 6 5.08,2.54
POWER_JACK_SLOT = drill 1 pad 2 long: GND@1 2.58,7.5; GND@2 7.58,10.8; PWR 2.58,13.8
1X04 = drill 1.016 square: 1 0,0 | drill 1.016: 2 2.54,0; 3 5.08,0; 4 7.62,0
2X7SEG_PTH = drill 1: 1 -10.16,-7.62; 2 -7.62,-7.62; 3 -5.08,-7.62; 4 -2.54,-7.62; 5 0,-7.62; 6 2.54,-7.62; 7 5.08,-7.62; 8 7.62,-7.62; 9 10.16,-7.62; 10 10.16,7.62; 11 7.62,7.62; 12 5.08,7.62; 13 2.54,7.62; 14 0,7.62; 15 -2.54,7.62; 16 -5.08,7.62; 17 -7.62,7.62; 18 -10.16,7.62
SOT23-3 = smd 0.8 x 0.9: 1 -0.95,-1; 2 0.95,-1; 3 0,1.1
SOT23 = smd 0.8 x 0.9: 1 -0.95,-1; 2 0.95,-1; 3 0,1
0805 = smd 0.8 x 1.2: 1 -0.9,0; 2 0.9,0
320E1-1 = drill 1.3 square: P$1 0,0; P$2 5.08,5.08 | hole 1: 2.54,-2.54; -2.54,5.08
TQFP100 = smd 1.5 x 0.3: 1 -8,6; 2 -8,5.5; 3 -8,5; 4 -8,4.5; 5 -8,4; 6 -8,3.5; 7 -8,3; 8 -8,2.5; 9 -8,2; 10 -8,1.5; 11 -8,1; 12 -8,0.5; 13 -8,0; 14 -8,-0.5; 15 -8,-1; 16 -8,-1.5; 17 -8,-2; 18 -8,-2.5; 19 -8,-3; 20 -8,-3.5; 21 -8,-4; 22 -8,-4.5; 23 -8,-5; 24 -8,-5.5; 25 -8,-6; 51 8,-6; 52 8,-5.5; 53 8,-5; 54 8,-4.5; 55 8,-4; 56 8,-3.5; 57 8,-3; 58 8,-2.5; 59 8,-2; 60 8,-1.5; 61 8,-1; 62 8,-0.5; 63 8,0; 64 8,0.5; 65 8,1; 66 8,1.5; 67 8,2; 68 8,2.5; 69 8,3; 70 8,3.5; 71 8,4; 72 8,4.5; 73 8,5; 74 8,5.5; 75 8,6 | smd 0.3 x 1.5: 26 -6,-8; 27 -5.5,-8; 28 -5,-8; 29 -4.5,-8; 30 -4,-8; 31 -3.5,-8; 32 -3,-8; 33 -2.5,-8; 34 -2,-8; 35 -1.5,-8; 36 -1,-8; 37 -0.5,-8; 38 0,-8; 39 0.5,-8; 40 1,-8; 41 1.5,-8; 42 2,-8; 43 2.5,-8; 44 3,-8; 45 3.5,-8; 46 4,-8; 47 4.5,-8; 48 5,-8; 49 5.5,-8; 50 6,-8; 76 6,8; 77 5.5,8; 78 5,8; 79 4.5,8; 80 4,8; 81 3.5,8; 82 3,8; 83 2.5,8; 84 2,8; 85 1.5,8; 86 1,8; 87 0.5,8; 88 0,8; 89 -0.5,8; 90 -1,8; 91 -1.5,8; 92 -2,8; 93 -2.5,8; 94 -3,8; 95 -3.5,8; 96 -4,8; 97 -4.5,8; 98 -5,8; 99 -5.5,8; 100 -6,8
TO263 = smd 1.067 x 2.54: 1 -2.54,-6.6; 2 0,-6.6; 3 2.54,-6.6 | smd 12.7 x 7.62: TAB 0,4.262

### Placement (x,y rotation side)
$2_80_$  1.78,90.17 0 top
$2_85_$  134.37,3.05 0 top
C1  129.29,57.28 270 top
C2  132.84,46.99 270 top
C3  119.13,36.58 180 top
C4  124.97,36.7 180 top
C5  109.22,56.77 90 top
C6  123.7,11.68 270 top
C7  133.48,38.99 90 top
C8  106.3,52.07 270 top
J1  134.24,18.54 180 top
J2  140.21,23.11 90 top
JP1  134.87,74.29 90 top
LED1  16.51,83.82 0 top
LED2  67.31,83.82 0 top
LED3  92.71,83.82 0 top
LED4  118.11,83.82 0 top
LED5  41.91,83.82 0 top
LOGO1  84.45,96.39 0 top
Q1  5.59,70.87 0 top
Q2  70.99,70.99 0 top
Q3  42.93,70.87 0 top
Q4  88.9,70.74 0 top
Q5  19.05,70.87 0 top
Q6  95.38,70.87 0 top
Q7  49.66,70.87 0 top
Q8  124.59,96.65 90 top
Q9  67.31,70.99 0 top
Q10  134.11,91.82 90 top
Q11  117.73,62.61 0 top
Q12  115.7,65.66 0 top
Q13  113.28,62.61 0 top
Q14  119.76,65.66 0 top
Q15  111.38,65.66 0 top
Q16  109.35,62.61 0 top
Q17  107.31,65.66 0 top
Q18  104.01,65.41 0 top
Q19  134.49,62.87 0 top
Q20  132.59,59.31 0 top
Q21  132.21,65.79 0 top
Q22  130.05,62.48 0 top
Q23  128.02,65.79 0 top
Q24  125.86,62.48 0 top
Q25  123.83,65.66 0 top
Q26  121.79,62.61 0 top
R1  133.35,69.6 90 top
R2  131.83,69.6 90 top
R3  130.3,69.6 90 top
R4  128.78,69.6 90 top
R5  127.25,69.6 90 top
R6  125.73,69.6 90 top
R7  124.21,69.6 90 top
R8  122.68,69.6 90 top
R15  119.63,69.6 90 top
R16  118.11,69.6 90 top
R17  116.59,69.6 90 top
R20  115.06,69.6 90 top
R21  113.54,69.6 90 top
R22  112.01,69.6 90 top
R23  110.49,69.6 90 top
R24  108.97,69.6 90 top
SWA1  11.43,59.69 0 top
SWA2  27.94,59.69 0 top
SWA3  44.45,59.69 0 top
SWA4  60.96,59.69 0 top
SWA5  77.47,59.69 0 top
SWA6  93.98,59.69 0 top
SWB1  11.43,43.18 0 top
SWB2  27.94,43.18 0 top
SWB3  44.45,43.18 0 top
SWB4  60.96,43.18 0 top
SWB5  77.47,43.18 0 top
SWB6  93.98,43.18 0 top
SWC1  11.43,26.67 0 top
SWC2  27.94,26.67 0 top
SWC3  44.45,26.67 0 top
SWC4  60.96,26.67 0 top
SWC5  80.52,17.27 180 top
SWC6  93.98,26.67 0 top
SWD1  11.43,10.16 0 top
SWD2  27.94,10.16 0 top
SWD3  44.45,10.16 0 top
SWD4  60.96,10.16 0 top
SWD6  93.98,10.16 0 top
U1  119.51,49.02 90 top
U$1  STAND-OFF  [STAND-OFF]  37.34,19.56 0 top
U$2  126.75,100.58 0 top
U$3  82.04,1.78 0 top
U$4  19.81,2.54 0 top
U$5  3.3,53.34 0 top
U$6  STAND-OFF  [STAND-OFF]  3.05,3.05 0 top
U$7  3.05,99.57 0 top
U$8  134.11,99.57 0 top
U$10  STAND-OFF  [STAND-OFF]  70.87,3.05 0 top
U$11  STAND-OFF  [STAND-OFF]  54.1,36.32 0 top
U$12  STAND-OFF  [STAND-OFF]  21.08,36.32 0 top
U$13  STAND-OFF  [STAND-OFF]  70.61,52.83 0 top
U$15  STAND-OFF  [STAND-OFF]  103.38,70.36 0 top
U$16  STAND-OFF  [STAND-OFF]  37.59,69.34 0 top
U$17  STAND-OFF  [STAND-OFF]  86.87,36.07 0 top
U$18  STAND-OFF  [STAND-OFF]  37.34,52.83 0 top
U$19  STAND-OFF  [STAND-OFF]  70.36,19.56 0 top
VR1  114.3,22.1 90 top

### Tracks (layer width: path | path; a pad name or v marks a point on that pad's centre or on a via)
+3V3  (via drill 0.38)
  Top 0.203: U1.54 124.01,58.35 124.46,58.8 128.61,58.8 C1.1 129.77,58.13 132.56,55.34 | 128.66,52.02 U1.44 127.46,52.07 126.24,52.07 125.86,51.69 119.25,51.69 119.01,51.93 U1.64 | U1.83 110.15,51.52 110.02,51.65 108.97,51.65 108.97,46.86 109.85,45.97 111.46,45.97 U1.94 111.76,45.97 112.52,45.97 115.06,43.43 115.06,41.15 U1.4 | U1.74 114.05,57.06 114.05,55.5 113.92,55.37 112.78,55.37 112.23,55.92 C5.1 | U1.34 130.4,47.02 131.19,46.23 | v132.46,72.64 133.22,72.64 JP1.1
  Top 0.254: C3.1 119.98,40.99 U1.14 | U1.24 125.01,37.51 C4.1 | Q22.2 131,61.91 v130.94,62.61 | Q19.2 136.13,61.87 136.4,61.6 | Q24.2 126.81,62.42 v126.75,62.61 | Q26.2 123.38,62.16 v123.95,62.74 | Q16.2 110.3,62.54 v110.36,62.74 | Q11.2 118.68,62.54 v118.74,62.74 | Q20.2 133.54,57.98 134.37,57.15 | v114.3,62.74 114.3,61.68 Q13.2
  Top 0.305: 105.03,65.41 102.49,65.41 101.85,64.77 101.85,63.63 102.62,62.87 103.5,62.87 104.77,61.6 104.77,59.69 106.05,58.42 106.05,56.64 | 116.59,65.66 112.39,65.66 108.2,65.66 | 120.52,65.66 116.59,65.66 | Q18.2 104.96,65.34 105.03,65.41 | Q17.2 108.27,65.6 108.2,65.66 | Q12.2 116.65,65.6 116.59,65.66 | Q14.2 120.71,65.47 120.52,65.66 | 124.77,65.6 Q25.2 | 124.77,65.6 124.71,65.66 120.52,65.66 | Q23.2 128.97,65.72 128.91,65.79 | 128.91,65.79 124.96,65.79 124.77,65.6 | 133.35,65.91 133.22,65.91 | 133.22,65.91 129.03,65.91 128.91,65.79 | Q21.2 133.16,65.85 133.22,65.91 | 105.03,65.41 105.28,65.66 108.2,65.66
  Top 0.406: 132.56,48.12 C2.1 132.02,47.02 131.99,47.02 131.19,46.23 130.56,45.59 130.56,41.44 125.91,36.79 | 132.56,48.12 128.66,52.02 | 125.91,36.79 C4.1 | 125.91,36.79 125.91,34.59 125.48,34.16 122.39,34.16 121.97,34.58 | 121.97,34.58 C3.1 | 100.58,53.21 102.15,51.65 106.55,51.65 | 121.97,34.58 121.97,34.21 116.59,28.83 | 132.56,48.12 132.56,55.34 134.37,57.15 136.27,57.15 136.4,57.28 136.4,61.6 136.4,65.79 135.76,66.42 134.24,66.42 | 133.35,65.91 133.73,65.91 134.24,66.42 | 134.24,66.42 v134.24,66.29 | Q15.2 112.33,65.59 112.39,65.66 | 106.55,51.65 108.97,51.65 | C8.+ 106.3,51.9 106.55,51.65 | 106.05,56.64 106.05,55.88 | 106.05,55.88 106.05,54.99 106.43,54.61 | C5.1 106.08,55.92 106.05,55.88
  Top 0.61: VR1.2 122.05,22.1 | 110.49,16.38 110.49,21.65 VR1.TAB
  Top 1.016: 122.05,22.1 122.17,21.97 124.59,21.97 125.98,20.57 125.98,16.76 C6.+ 125.6,12.57 133.1,12.57 134.24,13.72 J1.2
  Top 1.27: VR1.TAB VR1.2
  Bottom 0.203: 132.97,72.14 v132.46,72.64
  Bottom 0.406: 132.97,72.14 134.24,70.87 v134.24,66.29 134.24,62.74 132.84,62.74 132.59,62.61 v130.94,62.61 v126.75,62.61 124.46,62.61 124.21,62.74 v123.95,62.74 v118.74,62.74 v114.3,62.74 v110.36,62.74
  pour Top (isolate 0.61, no thermals): 115.06,13.72 86.61,13.72 86.61,6.6 7.37,6.6 7.37,69.09 101.35,69.09 101.35,29.97 117.09,29.97 117.09,13.72
+5V
  Top 1.016: C7.+ 129.67,36.2 125.35,31.88 125.35,26.75 J2.PWR 121.96,25.69 VR1.3
COL1
  Top 0.203: SWB1.P$1 21.97,43.18 24.89,46.1 36.83,46.1 42.55,51.82 67.18,51.82 69.98,49.02 73.02,49.02 76.07,52.07 99.95,52.07 106.55,45.47 111.45,45.47 U1.95
  Bottom 0.406: SWA1.P$1 SWB1.P$1 SWC1.P$1 SWD1.P$1
COL2
  Top 0.203: U1.96 104.84,45.02 104.27,45.59 97.03,45.59 95.76,46.86 89.79,46.86 88.9,45.97 77.98,45.97 77.47,46.48 76.71,46.48 76.33,46.1 43.05,46.1 40.13,43.18 SWB2.P$1
  Bottom 0.254: SWA2.P$1 SWB2.P$1 SWC2.P$1 SWD2.P$1
COL3  (via drill 0.38)
  Top 0.203: v89.66,45.09 90.68,46.1 95.76,46.1 96.77,45.09 104.14,45.09 104.65,44.58 111.45,44.58 U1.97 | 46.74,45.47 v77.09,45.47
  Top 0.254: SWB3.P$1 46.74,45.47
  Bottom 0.203: v89.66,45.09 77.47,45.09 v77.09,45.47
  Bottom 0.254: SWD3.P$1 SWC3.P$1 44.07,27.05 44.07,42.8 SWB3.P$1 SWA3.P$1
COL4  (via drill 0.38)
  Top 0.203: v99.31,41.15 98.55,41.91 96.14,41.91 95.12,40.89 93.85,40.89 92.58,42.16 79.5,42.16 78.49,41.15 74.93,41.15 72.9,43.18 SWB4.P$1 | 102.41,44.02 v102.36,44.07 102.49,43.94 110.11,43.94 110.24,44.07 111.46,44.07 U1.98
  Bottom 0.203: v99.31,41.15 99.44,41.15 v102.36,44.07
  Bottom 0.254: SWD4.P$1 SWC4.P$1 SWB4.P$1 SWA4.P$1
COL5  (via drill 0.38)
  Top 0.203: v90.55,44.07 91.69,45.21 95.88,45.21 98.04,43.05 109.73,43.05 110.2,43.52 U1.99
  Bottom 0.203: 78.36,44.07 v90.55,44.07
  Bottom 0.254: SWB5.P$1 75.18,40.89 75.18,17.53 80.26,17.53 SWC5.P$1 | SWB5.P$1 75.69,43.18 73.79,45.09 73.79,55.63 77.98,59.82 77.6,59.82 SWA5.P$1 | SWB5.P$1 78.36,44.07
COL6  (via drill 0.38)
  Top 0.203: 109.17,40.69 109,40.51 | 109.17,40.69 U1.100 | v108.97,40.64 109.22,40.64 109.17,40.69
  Top 0.254: SWA6.P$1 88.14,59.69 v88.01,59.56
  Bottom 0.203: v108.97,40.64 104.39,36.07 94.11,36.07 93.98,36.07
  Bottom 0.254: SWD6.P$1 SWC6.P$1 93.98,35.94 94.11,36.07 94.11,43.05 SWB6.P$1 92.07,45.09 91.69,45.09 88.01,48.77 v88.01,59.56
DIGA0  (via drill 0.38)
  Top 0.203: v67.31,96.52 LED2.16 | v81.79,97.79 87.63,91.95 LED3.16 | LED1.11 v26.16,93.47 | v107.19,97.28 LED4.16 116.97,87.5 125.6,87.5 131.06,82.04 131.06,75.44 131.7,74.8 131.7,72.14 132.32,71.51 132.33,71.51 R1.2
  Bottom 0.203: LED1.16 12.7,90.17 22.86,90.17 LED1.11 | v81.79,97.79 68.58,97.79 v67.31,96.52 29.21,96.52 v26.16,93.47 | 106.68,97.79 v107.19,97.28
  Bottom 0.254: v81.79,97.79 106.68,97.79
DIGA1  (via drill 0.38)
  Top 0.203: v116.59,84.96 117.35,84.2 125.35,84.2 130.43,79.12 130.43,74.93 131.06,74.29 131.06,71.26 R2.2 | v53.85,88.9 62.23,88.9 LED2.15 66.55,93.22 69.6,93.22 71.12,91.69 71.12,91.19 73.91,88.39 87.12,88.39 87.88,89.15 | 87.88,89.15 LED3.15 | 87.88,89.15 v89.41,87.63
  Bottom 0.203: LED1.15 12.7,92.71 11.18,92.71 10.16,91.69 10.16,91.19 11.68,89.66 24.89,89.66 LED1.10 29.72,88.39 53.34,88.39 v53.85,88.9
  Bottom 0.254: v116.59,84.96 115.57,85.98 LED4.15 110.62,86.49 90.55,86.49 v89.41,87.63
DIGA2  (via drill 0.38)
  Top 0.203: R3.2 130.3,70.74 127.13,73.91 115.32,73.91 LED4.3 | 60.96,77.47 58.42,80.01 v54.1,80.01 | 60.96,77.47 LED2.3 | v26.92,79.5 24.13,76.71 LED1.8 | LED3.3 85.6,78.23 85.6,78.74 v84.33,80.01 | 60.96,77.47 v64.77,81.28 | v95.25,73.91 v104.14,73.91
  Bottom 0.203: LED1.3 12.7,74.93 16.76,74.93 17.78,75.95 17.78,76.96 18.29,77.47 22.86,77.47 LED1.8 | v54.1,80.01 53.85,80.26 42.93,80.26 42.16,79.5 v26.92,79.5 | v84.33,80.01 83.06,81.28 v64.77,81.28 | LED4.3 111.25,74.42 110.24,74.42 109.47,73.66 104.9,73.66 104.65,73.91 v104.14,73.91 | v95.25,73.91 95,73.66 91.19,73.66 88.65,76.2 LED3.3
DIGA3  (via drill 0.38)
  Top 0.203: R4.2 128.78,71.37 126.87,73.28 113.41,73.28 LED4.2 | v87.88,72.39 84.84,75.44 84.84,75.95 LED3.2
  Bottom 0.203: LED1.2 10.67,74.42 17.27,74.42 | 17.27,74.42 LED1.6 | 57.15,73.66 LED2.2 | 57.15,73.66 56.13,73.66 55.37,74.42 17.27,74.42 | LED3.2 82.55,73.66 57.15,73.66 | LED4.2 108.46,74.17 105.16,74.17 104.65,74.68 103.89,74.68 102.87,73.66 97.54,73.66 96.27,72.39 v87.88,72.39
DIGA4  (via drill 0.38)
  Top 0.203: R5.2 127.25,72.01 126.49,72.77 111.38,72.77 v110.49,73.66 LED4.1 | LED3.1 v87.38,71.37
  Bottom 0.203: LED1.1 7.62,77.47 14.22,77.47 | 14.22,77.47 15.49,76.2 LED1.5 | 55.37,77.98 LED2.1 | 55.37,77.98 51.31,77.98 50.8,77.47 26.16,77.47 25.15,78.49 15.24,78.49 14.22,77.47 | LED3.1 80.01,78.74 56.13,78.74 55.37,77.98 | v110.49,73.66 109.98,73.15 99.82,73.15 98.04,71.37 v87.38,71.37
DIGA5  (via drill 0.38)
  Top 0.203: R6.2 125.73,71.12 v126.36,71.75 | v125.35,78.1 125.35,78.36 122.94,80.77 112.01,80.77 108.08,84.71 108.08,91.31 LED4.18 v103.63,95.76
  Bottom 0.203: v126.36,71.75 129.79,75.18 129.79,77.6 126.75,80.65 125.22,80.65 124.97,80.39 124.97,78.49 v125.35,78.1 | LED1.18 8.13,93.22 19.81,93.22 20.32,92.71 | 20.32,92.71 LED1.12 | 20.32,92.71 26.92,92.71 30.73,88.9 45.72,88.9 46.48,89.66 55.37,89.66 LED2.18 58.17,91.44 60.71,93.98 80.01,93.98 | 80.01,93.98 LED3.18 | v103.63,95.76 103.38,96.01 100.08,96.01 99.57,96.52 82.55,96.52 80.01,93.98
DIGA6  (via drill 0.38)
  Top 0.203: R7.2 124.21,71.25 v124.84,71.88 | v125.98,79.12 125.98,80.14 123.44,82.68 113.92,82.68 110.62,85.98 110.62,91.31 LED4.17 | LED1.7 v21.59,79.76
  Bottom 0.203: v124.84,71.88 124.84,72.52 127.13,74.8 127.13,77.98 v125.98,79.12 | v21.59,79.76 12.19,89.15 9.91,89.15 8.89,90.17 LED1.17 | 57.15,88.9 LED2.17 | 82.55,88.9 82.8,89.15 | 82.8,89.15 83.31,89.66 LED3.17 | 82.8,89.15 83.57,88.39
  Bottom 0.254: v21.59,79.76 26.04,84.2 52.45,84.2 57.15,88.9 82.55,88.9 83.31,89.66 | LED4.17 110.49,89.15 108.58,87.25 91.57,87.25 90.04,88.77 88.9,88.77 87.88,87.76 84.2,87.76 83.57,88.39
DIGA7  (via drill 0.38)
  Top 0.203: v122.68,71.63 R8.2 | v125.09,74.68 117.09,74.68 LED4.4 113.79,77.98 107.19,77.98 106.93,77.72 106.43,77.72 105.92,78.23 105.92,80.01 v106.43,80.52 | LED1.4 v15.24,77.47 | LED2.4 62.99,74.42 56.39,74.42 v49.28,81.53 | v30.23,80.26 26.67,76.71 LED1.9 | LED3.4 90.17,77.98 89.41,78.74 89.41,80.01 v89.66,80.26
  Bottom 0.203: v125.09,74.68 122.68,72.26 v122.68,71.63 | v15.24,77.47 15.75,77.98 24.89,77.98 LED1.9 | v30.23,80.26 39.37,80.26 40.64,81.53 v49.28,81.53 49.78,82.04 87.88,82.04 v89.66,80.26 106.17,80.26 v106.43,80.52
DIGAG0  (via drill 0.38)
  Top 0.203: Q19.1 133.54,60.89 v133.86,60.58 | v123.57,54.86 123.57,56.96 U1.55
  Bottom 0.203: v133.86,60.58 130.68,57.4 126.11,57.4 v123.57,54.86
DIGAG1
  Top 0.203: U1.56 123.01,57.98 124.33,59.31 130.64,59.31 Q20.1
DIGAG2
  Top 0.203: U1.57 122.51,58.12 124.21,59.82 130.94,59.82 131.83,60.71 131.83,62.87 131.26,63.43
  Top 0.254: 131.26,63.43 Q21.1
DIGAG3
  Top 0.203: U1.58 122.01,58.25 124.08,60.32 127.94,60.32 Q22.1
DIGAG4
  Top 0.203: U1.59 121.51,58.39 123.83,60.71 127.64,60.71 128.02,61.09 128.02,63.84 Q23.1
DIGAG5
  Top 0.203: Q24.1 123.97,61.48 121.03,58.55 121.03,57.05 U1.60
DIGAG6
  Top 0.203: U1.61 120.51,58.79 121.92,60.2 121.92,62.23 122.94,63.25 122.94,64.6 Q25.1
DIGAG7
  Top 0.203: Q26.1 120.84,59.76 120.02,58.93 U1.62
DIGAP0  (via drill 0.38)
  Top 0.254: Q19.3 133.46,63.87 v133.35,63.75 | v133.22,67.56 133.22,68.57 R1.1
  Bottom 0.254: v133.35,63.75 133.35,67.44 v133.22,67.56
DIGAP1  (via drill 0.38)
  Top 0.203: R2.1 131.95,68.57
  Top 0.254: v131.45,67.69 131.45,68.31 R2.1 | v132.21,63.88 132.33,63.75 132.33,63.25 132.72,62.87 132.72,60.44 Q20.3
  Bottom 0.254: v132.21,63.88 132.21,66.93 v131.45,67.69
DIGAP2
  Top 0.305: Q21.3 130.7,66.79 130.3,67.18 R3.1
DIGAP3  (via drill 0.38)
  Top 0.254: Q22.3 130.05,64.77 v130.18,64.9 | v129.16,67.31 129.16,68.31 R4.1
  Bottom 0.254: v130.18,64.9 130.18,66.29 v129.16,67.31
DIGAP4
  Top 0.305: Q23.3 128.02,67.06 127.25,67.82 R5.1
DIGAP5  (via drill 0.38)
  Top 0.254: Q24.3 125.86,64.64 v125.98,64.77 | v125.73,66.8 R6.1
  Bottom 0.254: v125.98,64.77 125.98,66.55 v125.73,66.8
DIGAP6
  Top 0.305: Q25.3 123.83,67.18 124.21,67.56 R7.1
DIGAP7  (via drill 0.38)
  Top 0.254: Q26.3 v121.79,64.77 | v122.43,67.31 122.43,68.44 R8.1
  Bottom 0.254: v121.79,64.77 121.79,66.68 v122.43,67.31
DIGB0  (via drill 0.38)
  Top 0.203: R15.2 120.66,70.5 v121.16,70.49 | v38.86,93.47 LED5.16 | v74.93,95.5 LED2.11 | v100.33,96.77 LED3.11
  Bottom 0.203: v121.16,70.49 127.38,70.49 130.81,73.91 130.81,86.36 LED4.11 | v38.86,93.47 39.12,93.22 47.75,93.22 LED5.11 52.58,94.49 66.29,94.49 68.33,96.52 74.93,96.52 | 74.93,96.52 v74.93,95.5 | v100.33,96.77 100.08,97.03 75.44,97.03 74.93,96.52
  Bottom 0.254: LED4.11 125.73,94.74 123.7,96.77 108.46,96.77 107.57,95.88 105.54,95.88 104.65,96.77 v100.33,96.77
DIGB1  (via drill 0.38)
  Top 0.203: R16.2 118.11,71.37 118.62,71.88 120.02,71.88 v120.4,71.5 | v127.38,88.01 127.38,90.55 LED4.10 | v35.05,89.66 37.59,89.66 LED5.15 v45.21,97.28 | 77.98,90.93 79.76,89.15 v86.87,89.15 | v77.98,98.55 77.98,90.93 | 77.98,90.93 LED2.10
  Bottom 0.203: v120.4,71.5 120.4,72.26 121.92,73.79 122.94,73.79 124.33,75.18 124.33,84.96 v127.38,88.01 | v35.05,89.66 35.31,89.41 45.47,89.41 46.23,90.17 50.8,90.17 LED5.10 | v86.87,89.15 87.12,88.9 | v45.21,97.28 46.48,98.55 v77.98,98.55
  Bottom 0.254: 87.12,88.9 87.63,88.9 88.27,89.53 100.96,89.53 LED3.10 | LED4.10 128.27,96.14 126.36,98.04 108.97,98.04 108.33,98.68 78.1,98.68 v77.98,98.55
DIGB2  (via drill 0.38)
  Top 0.203: R17.2 116.59,70.99 v117.6,72.01 | LED4.8 123.95,77.98 v123.06,77.98 122.94,77.98 121.92,78.99 107.19,78.99 v106.68,78.49 | LED5.3 v38.86,78.23 | v48.01,78.23 49.53,76.71 LED5.8 v52.32,73.41 | v78.23,72.9 LED2.8
  Bottom 0.203: v117.6,72.01 118.11,72.01 121.79,75.69 121.79,76.71 v123.06,77.98 | v38.86,78.23 39.12,77.98 47.75,77.98 v48.01,78.23 | 100.08,76.2 99.31,76.2 96.27,73.15 78.49,73.15 v78.23,72.9 77.72,72.39 53.34,72.39 v52.32,73.41 | v106.68,78.49 106.43,78.74 101.85,78.74 100.08,76.96 100.08,76.2 | 100.08,76.2 LED3.8
DIGB3  (via drill 0.38)
  Top 0.203: R20.2 115.06,70.74 v116.08,71.75 | v40.89,75.18 40.13,74.42 36.07,74.42 LED5.2 v39.12,81.03 | LED2.6 71.12,77.47 71.12,78.99 70.87,79.25 70.87,79.76 71.88,80.77 72.64,80.77 | 72.64,80.77 85.34,80.77 v88.14,77.98 | LED3.6 v97.79,78.74 | v70.61,82.8 72.64,80.77
  Bottom 0.203: v116.08,71.75 116.2,71.75 120.14,75.69 | v40.89,75.18 41.15,74.93 43.18,74.93 LED5.6 | v88.14,77.98 88.65,77.47 92.96,77.47 94.23,76.2 LED3.6 | 120.14,75.69 116.59,79.25 98.3,79.25 v97.79,78.74 | 120.14,75.69 LED4.6 | v39.12,81.03 40.89,82.8 v70.61,82.8
DIGB4  (via drill 0.38)
  Top 0.203: R21.2 113.54,71.63 v113.67,71.75 | v67.31,80.01 LED2.5 | v42.42,80.77 42.67,80.52 42.67,76.96 LED5.5 | LED3.5 90.17,78.74 v90.17,79.25 | LED4.5 118.11,76.71 v119.13,77.72
  Bottom 0.203: LED4.5 v113.67,71.75 | LED5.1 33.02,74.93 39.62,74.93 40.89,76.2 LED5.5 | 67.06,80.26 66.8,80.52 54.61,80.52 54.36,80.77 v42.42,80.77 | 67.06,80.26 71.88,80.26 72.9,79.25 v90.17,79.25 90.68,79.76 117.09,79.76 v119.13,77.72 | 67.06,80.26 v67.31,80.01
DIGB5
  Top 0.203: R22.2 112.01,71.37 110.49,72.9 108.84,72.9 105.54,76.2 105.54,83.69 LED3.12 89.92,99.31 77.72,99.31 71.12,92.71 | 71.12,92.71 68.07,95.76 68.07,96.77 67.56,97.28 52.83,97.28 LED5.12 | 71.12,92.71 LED2.12
  Bottom 0.203: LED4.12 120.65,93.98 101.35,93.98 98.81,91.44 LED3.12 | LED5.18 33.02,92.71 45.72,92.71 LED5.12
DIGB6  (via drill 0.38)
  Top 0.203: R23.2 110.49,71.75 v110.36,71.88 110.24,71.88 109.73,72.39 108.71,72.39 103.12,77.98 99.57,77.98 LED3.7 | LED5.7 v46.99,79.5 46.99,88.39 v45.21,90.17 | 73.66,77.47 74.68,78.49 v84.84,78.49 | 73.66,77.47 LED2.7 | v71.63,79.5 73.66,77.47
  Bottom 0.203: v110.36,71.88 111.63,71.88 112.78,70.74 117.73,70.74 LED4.7 | v45.21,90.17 35.56,90.17 LED5.17 | v84.84,78.49 85.09,78.74 89.66,78.74 89.92,78.49 90.42,78.49 90.68,78.74 94.23,78.74 96.77,76.2 LED3.7 | v46.99,79.5 53.59,79.5 53.85,79.25 71.37,79.25 v71.63,79.5
DIGB7  (via drill 0.38)
  Top 0.203: R24.2 108.57,70.5 106.3,72.77 | LED5.4 v41.91,78.74 | v50.55,78.23 52.07,76.71 LED5.9 | LED2.9 v83.31,70.36 | v93.22,69.34 96.52,66.04 100.2,66.04 101.47,67.31 104.27,67.31 105.03,68.07 | LED4.9 130.05,74.42 v130.05,72.14 | 105.03,68.07 106.3,69.34 106.3,72.77 | 106.3,72.77 LED3.9 | 105.03,68.07 107.44,68.07 v107.7,68.33
  Bottom 0.203: v41.91,78.74 47.5,78.74 47.75,78.99 49.78,78.99 v50.55,78.23 | v83.31,70.36 84.33,69.34 v93.22,69.34
  Bottom 0.254: v107.7,68.33 108.71,68.33 109.6,69.22 127.13,69.22 v130.05,72.14 | LED2.9 76.07,77.6 58.8,77.6 58.42,77.22 58.42,75.69 57.28,74.55 56.01,74.55 54.1,76.45 52.32,76.45 LED5.9
DIGBG0
  Top 0.203: U1.65 118.51,59.2 119.89,60.58 119.89,63.58 Q14.1
DIGBG1
  Top 0.203: U1.66 118.01,60.38 Q11.1
DIGBG2
  Top 0.203: U1.67 117.51,59.53 115.44,61.6 115.44,63.96 Q12.1
DIGBG3
  Top 0.203: U1.68 116.97,57.06 116.97,57.71 117.07,57.81 117.07,59.08 115.44,60.71 113.24,60.71 Q13.1
DIGBG4
  Top 0.203: Q15.1 110.73,64.66 111.25,64.13 111.25,61.21 112.01,60.45 112.78,60.45 113.03,60.2 115.21,60.2 116.51,58.9 U1.69
DIGBG5
  Top 0.203: U1.70 116.01,58.74 115.06,59.69 110.32,59.69 Q16.1
DIGBG6
  Top 0.203: U1.71 115.51,58.48 114.81,59.18 109.35,59.18 106.93,61.6 106.93,64.09 Q17.1
DIGBG7
  Top 0.203: Q18.1 103.36,64.41 108.97,58.8 114.3,58.8 115.06,58.04 115.06,57.08 U1.72
DIGBP0
  Top 0.305: Q14.3 119.76,68.57 R15.1
DIGBP1  (via drill 0.38)
  Top 0.203: R16.1 118.01,68.59
  Top 0.254: Q11.3 v117.73,64.77 | v118.11,67.31 R16.1
  Bottom 0.254: v117.73,64.77 117.73,66.93 v118.11,67.31
DIGBP2
  Top 0.305: Q12.3 115.7,67.06 116.59,67.94 R17.1
DIGBP3  (via drill 0.38)
  Top 0.254: Q13.3 113.28,64.52 v113.54,64.77 | v114.68,67.44 114.68,68.31 R20.1
  Bottom 0.254: v113.54,64.77 113.54,66.29 v114.68,67.44
DIGBP4
  Top 0.305: Q15.3 112.25,66.66 113.67,68.07 113.67,68.57 R21.1
DIGBP5  (via drill 0.38)
  Top 0.254: Q16.3 v109.35,64.77 | v111.89,67.69 111.89,68.57 R22.1
  Bottom 0.254: v109.35,64.77 109.35,65.15 v111.89,67.69
DIGBP6
  Top 0.305: Q17.3 109.33,66.66 110.49,67.82 R23.1
DIGBP7
  Top 0.305: R24.1 108.97,67.82 108.71,67.56 105.17,67.56 Q18.3
GND  (via drill 0.38)
  Top 0.203: C2.2 132.46,46.52 | U1.33 129.25,46.52 | 125.73,55.12 124.97,55.12 124.51,55.58 U1.53 | U1.63 119.51,55.5 121.03,53.98 | U1.43 128.31,51.52 128.91,50.93 128.91,49.66 v129.03,50.29 | U1.93 113.12,46.52 113.28,46.35 | 113.79,51.05 111.47,51.05 110.36,51.05 110.11,50.8 110.11,50.04 v109.85,49.78 | 114.55,56.13 114.55,56.9 U1.73
  Top 0.254: U1.23 124.51,39.29 124.33,39.12 v123.95,39.12 | U1.13 119.51,39.24 119,38.73 v118.49,38.73 | U1.3 114.51,38.66 114.55,38.61 | 111.47,51.05 U1.84 | 114.55,56.13 114.55,55.75 114.93,55.37 116.08,55.37 v116.97,54.48
  Top 0.406: 129.25,46.52 129.25,45 v129.29,44.96
  other vias: 128.91,2.92 121.67,53.59 134.62,46.1 119,42.93 107.7,46.48 116.08,42.93 47.37,70.74 30.61,70.87 7.75,71.75 75.82,70.74 61.85,70.99 84.96,70.87 99.57,70.49 98.55,70.49 112.65,39.24 54.23,4.7 37.72,4.7 21.08,4.7 135.64,46.1 135.64,47.24 135.64,48.39 133.73,54.23 133.73,53.21 134.62,54.23 134.62,55.24 117.86,54.99 117.86,53.98 120.52,53.59 107.31,58.04 113.92,51.43 108.08,49.28 104.52,49.28 104.01,53.47 107.95,53.47 104.14,41.53 106.05,41.53 104.14,40.01 106.05,40.01 112.65,37.97 113.92,37.97 109.98,32.89 108.2,32.89 106.55,32.89 115.32,31.75 119.63,34.29 114.17,31.37 123.19,32.26 123.19,31.12 122.05,36.83 135.25,41.66 135.25,43.05 121.03,67.82 130.81,52.07 101.09,83.69 107.19,83.69 123.7,19.69 120.9,17.27 123.06,17.27 107.7,69.72 83.31,85.47 74.8,85.6 68.07,85.85 62.36,86.11 50.55,86.23 38.35,86.49 22.86,87.12 12.57,83.19 5.59,87.5 16.51,87.25 45.85,86.23 106.3,90.17 107.95,94.23 113.79,95.63 117.35,100.33
  pour Bottom (isolate 0.305): -19.56,70.23 -19.56,-2.16 136.14,1.02 138.05,107.31 53.72,106.55 -3.05,102.24
  pour Top (isolate 0.254, rank 2): 6.98,-3.3 137.54,-2.03 137.41,102.62 -3.3,102.62 -3.3,-2.54 6.35,-2.54
N$1  (via drill 0.38)
  Top 0.203: v115.19,46.74 115.19,48.64 114.68,49.15 113.79,49.15 113.16,48.51 U1.89
  Bottom 0.203: v115.19,46.74 114.17,45.72 114.17,43.56 109.47,38.86 109.47,37.46 112.78,34.16 117.35,34.16 122.55,28.96 122.55,24.26 126.11,20.7 132.08,20.7 J1.1
N$2  (via drill 0.38)
  Top 0.203: U1.90 111.52,48.01 114.05,48.01 v114.17,47.88
  Bottom 0.203: v114.17,47.88 113.41,47.12 113.41,43.69 108.46,38.73 108.46,37.46 112.52,33.4 117.22,33.4 121.79,28.83 121.79,23.75 127,18.54 J1.5
ROWA  (via drill 0.38)
  Top 0.203: v104.27,36.96 114.55,36.96 115.44,37.85 115.44,40.96 U1.5
  Bottom 0.203: SWA6.P$2 99.06,61.72 93.85,56.51 | 93.85,56.51 93.85,47.75 97.79,43.82 97.79,40.13 101.22,36.7 104.27,36.7 v104.27,36.96 | 93.85,56.51 92.33,56.51 85.72,63.12 84.2,63.12 SWA5.P$2 78.1,64.77 76.2,62.87 67.94,62.87 SWA4.P$2 61.72,64.77 59.31,62.36 51.94,62.36 SWA3.P$2 45.21,64.77 42.55,62.1 35.69,62.1 SWA2.P$2 28.45,64.77 25.91,62.23 19.05,62.23 SWA1.P$2
ROWB  (via drill 0.38)
  Top 0.203: U1.6 116.01,37.65 114.3,35.94 103.38,35.94 100.71,38.61 100.71,41.78 100.2,42.29 v99.44,42.29
  Top 0.254: SWB6.P$2 95,48.26 93.47,49.78 84.07,49.78 SWB5.P$2 76.96,48.26 75.44,46.74 67.56,46.74 SWB4.P$2 60.96,48.26 59.56,49.66 50.93,49.66 SWB3.P$2 44.07,48.26 v41.91,46.1 | SWB1.P$2 20.07,48.26 23.37,51.56 29.72,51.56 SWB2.P$2
  Bottom 0.203: v99.44,42.29 99.44,47.62 99.57,47.75
  Bottom 0.254: v41.91,46.1 35.18,46.1 SWB2.P$2 | 99.44,47.62 99.44,47.88 SWB6.P$2
ROWC  (via drill 0.38)
  Top 0.203: SWC6.P$2 112.9,31.75 116.46,35.31 116.46,40.97 U1.7
  Top 0.254: SWC1.P$2 16.76,31.75 19.81,28.7 29.97,28.7 SWC2.P$2 38.61,31.75 41.15,29.21 46.99,29.21 SWC3.P$2 53.97,31.75 57.02,28.7 62.99,28.7 SWC4.P$2 66.04,19.05 69.72,15.37 72.26,15.37 SWC5.P$2 | v89.41,28.83 93.09,28.83 94.74,30.48 97.79,30.48 SWC6.P$2
  Bottom 0.254: SWC5.P$2 80.01,12.19 85.09,17.27 85.09,24.51 v89.41,28.83
ROWD  (via drill 0.38)
  Top 0.203: U1.8 117.01,33.31 v116.97,32.51
  Top 0.254: SWD1.P$2 22.1,15.24 24.76,17.91 30.35,17.91 SWD2.P$2 38.99,15.24 41.78,12.45 46.74,12.45 SWD3.P$2 55.12,15.24 57.66,12.7 63.5,12.7 SWD4.P$2 66.55,15.24 73.28,8.51 86.49,8.51 90.68,12.7 96.52,12.7 SWD6.P$2
  Bottom 0.203: v116.97,32.51 116.97,31.24 106.3,20.57
  Bottom 0.254: 106.3,20.57 104.39,20.57 SWD6.P$2
RXD  (via drill 0.38)
  Top 0.203: U1.47 130.48,53.52 v131.32,54.36 | v133.35,76.07 133.35,77.85 JP1.3
  Bottom 0.203: v131.32,54.36 131.83,54.36 135.64,58.17 135.64,72.14 134.87,72.9 133.73,72.9 133.35,73.28 v133.35,76.07
SEGC0
  Top 0.305: Q1.3 5.59,74.29 4.44,75.44 4.44,81.03 11.56,88.14 15.24,88.14 16.51,89.41 LED1.14
SEGC1
  Top 0.305: Q3.3 42.93,74.8 43.18,75.06 43.18,90.17 LED5.14
SEGC2
  Top 0.305: Q5.3 19.05,73.79 17.78,75.06 17.78,90.17 LED1.13
SEGC3
  Top 0.305: LED5.13 44.45,78.74 45.72,77.47 45.72,74.04 46.36,73.41 48.22,73.41 Q7.3
SEGC4
  Top 0.305: Q9.3 67.31,73.91 66.04,75.18 66.04,90.17 LED2.14
SEGC5
  Top 0.305: LED2.13 69.85,78.23 68.58,76.96 68.58,74.51 Q2.3
SEGC6
  Top 0.305: Q4.3 88.9,85.98 92.71,89.79 LED3.14
SEGC7
  Top 0.305: LED3.13 95.25,79.76 93.85,78.36 93.85,73.49 Q6.3
SEGC8
  Top 0.305: Q8.3 118.87,96.65 118.11,95.88 LED4.14
SEGC9
  Top 0.305: Q10.3 133.01,92.92 131.32,94.62 123.83,94.62 LED4.13
SEGG0  (via drill 0.38)
  Top 0.203: Q1.1 4.64,68.9 5.21,68.33 17.91,68.33 18.8,67.44 34.04,67.44 35.94,65.53 39.12,65.53 39.88,66.29 52.45,66.29 53.59,67.44 65.91,67.44 67.06,66.29 73.66,66.29 74.42,67.06 84.71,67.06 86.11,65.66 88.52,65.66 90.55,63.63 93.6,63.63 98.68,58.55 101.22,58.55 102.74,57.02 v103.63,57.02 | v121.79,42.93 121.92,42.93 122.43,42.42 125.35,42.42 125.48,42.29 125.48,41.05 U1.25
  Bottom 0.203: v121.79,42.93 121.67,43.05 120.14,43.05 106.17,57.02 v103.63,57.02
SEGG1  (via drill 0.38)
  Top 0.203: Q3.1 41.98,69.15 42.55,68.58 47.12,68.58 v47.12,68.83 | U1.26 122.97,43.02 122.3,43.69 120.65,43.69 v119.25,45.09 | v104.77,58.17 104.65,58.04 102.49,58.04 101.47,59.05 98.81,59.05 91.69,66.17 86.36,66.17 84.96,67.56 74.17,67.56 73.41,66.8 67.31,66.8 66.17,67.94 53.21,67.94 52.45,67.18 v48.01,67.18
  Bottom 0.203: v47.12,68.83 47.12,68.07 v48.01,67.18 | v104.77,58.17 105.66,58.17 118.36,45.47 118.87,45.47 v119.25,45.09
SEGG2  (via drill 0.38)
  Top 0.203: Q5.1 18.1,69.4 18.8,68.71 33.91,68.71 36.58,66.04 38.73,66.04 40.77,68.07 47.5,68.07 47.62,68.2 52.58,68.2 53.72,69.34 62.1,69.34 62.99,68.45 66.42,68.45 67.56,67.31 73.15,67.31 73.91,68.07 85.09,68.07 86.49,66.68 91.82,66.68 98.93,59.56 101.73,59.56 102.49,58.8 v103.76,58.8 | U1.27 123.48,43.52 v122.05,44.96
  Bottom 0.203: v122.05,44.96 120.65,44.96 115.7,49.91 115.7,51.05 107.44,59.31 104.27,59.31 v103.76,58.8
SEGG3  (via drill 0.38)
  Top 0.203: Q7.1 48.71,69.15 49.15,68.71 51.6,68.71 52.74,69.85 62.36,69.85 63.25,68.96 66.67,68.96 67.82,67.82 72.9,67.82 73.66,68.58 85.22,68.58 86.61,67.18 91.95,67.18 98.81,60.32 102.74,60.32 v103.25,59.82 | U1.28 124.13,44.02 121.92,46.23 v121.67,46.23
  Bottom 0.203: v121.67,46.23 120.27,46.23 116.33,50.16 116.33,51.05 107.06,60.32 103.76,60.32 v103.25,59.82
SEGG4  (via drill 0.38)
  Top 0.203: U1.29 124.52,44.52 121.54,47.5 v121.28,47.5 | v103.63,61.21 103,61.21 102.62,60.83 98.93,60.83 92.07,67.69 86.74,67.69 85.34,69.09 73.41,69.09 72.64,68.33 68.03,68.33 Q9.1
  Bottom 0.203: v121.28,47.5 119.76,47.5 116.84,50.42 116.84,51.18 107.06,60.96 103.89,60.96 v103.63,61.21
SEGG5  (via drill 0.38)
  Top 0.203: Q2.1 70.04,69.4 70.61,68.83 72.39,68.83 73.15,69.6 85.72,69.6 87.12,68.2 92.2,68.2 98.68,61.72 100.46,61.72 100.84,61.34 101.85,61.34 v102.23,61.72 101.98,61.47 | U1.30 124.9,45.02 v121.28,48.64
  Bottom 0.203: v121.28,48.64 119.38,48.64 117.35,50.67 117.35,51.31 106.68,61.98 102.49,61.98 v102.23,61.72
SEGG6  (via drill 0.38)
  Top 0.203: U1.31 125.55,45.52 121.03,50.04 120.9,50.04 v120.52,49.66 | v101.09,62.23 98.81,62.23 92.2,68.83 88.52,68.83 87.95,69.4 Q4.1
  Bottom 0.203: v120.52,49.66 119.13,49.66 118.49,50.29 118.49,50.8 105.54,63.75 102.62,63.75 v101.09,62.23
SEGG7  (via drill 0.38)
  Top 0.203: v119.25,50.67 121.16,50.67 125.81,46.02 U1.32 | Q6.1 94.43,69.66 96.01,68.07 98.04,68.07 v99.31,66.8
  Bottom 0.203: v119.25,50.67 103.12,66.8 v99.31,66.8
SEGG8  (via drill 0.38)
  Top 0.203: Q8.1 128.42,95.7 134.43,95.7 v135.76,94.36 | v130.81,47.62 129.29,47.62 129.16,47.5 127.53,47.5 U1.35
  Bottom 0.203: v135.76,94.36 135.76,85.98 136.53,85.09 136.53,53.47 v130.81,47.62
SEGG9  (via drill 0.38)
  Top 0.203: U1.36 128.67,48.02 v129.03,48.39 | v135.38,84.84 135.38,86.4 135.13,86.65 135.13,90.85 Q10.1
  Bottom 0.203: v135.38,84.84 136.02,84.07 136.14,53.85 130.68,48.39 v129.03,48.39
TXD  (via drill 0.38)
  Top 0.203: U1.48 129.33,54.02 v130.43,55.12 | v132.72,74.8 133.22,74.8 134.11,75.69 134.11,76.07 JP1.2
  Bottom 0.203: v130.43,55.12 131.19,55.12 135,58.93 135,70.99 132.72,73.28 v132.72,74.8

### Text on the board
tPlace: GND | TX | RX | 3V3 | (c) 2011 StackFoundry LLC
tNames: Calcumaker | Rev2